# EAGLE schematic loa_v3 (EAGLE 6.5.0)

## Sheet 1 of 7
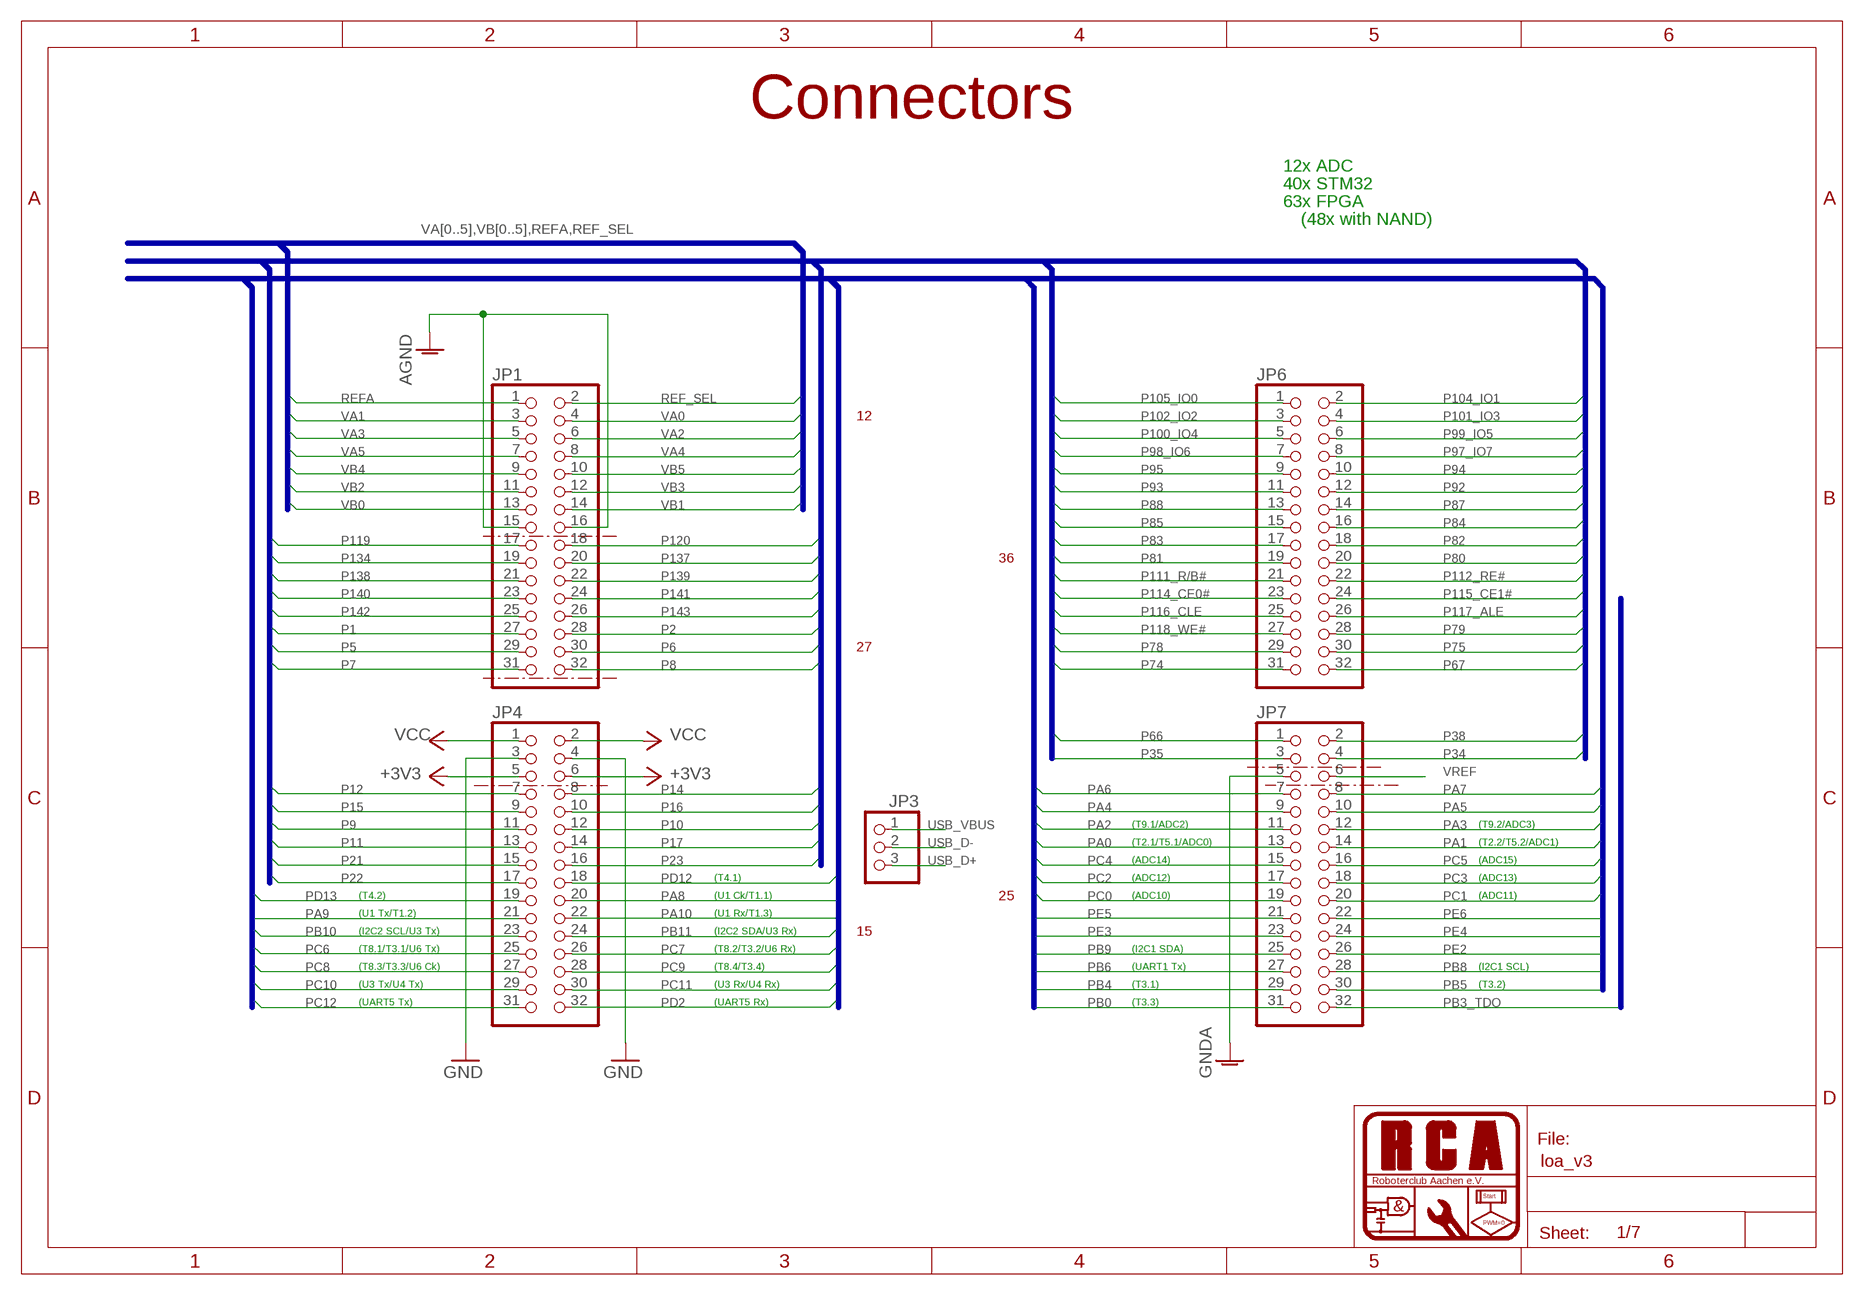
[diagram p0: schematic, sheet 1]

### Parts
JP1  PINHD-2X16_2.54  [2X16]
JP3  PINHD-1X3_2.54S  [1X03S]
JP4  PINHD-2X16_2.54  [2X16]
JP6  PINHD-2X16_2.54  [2X16]
JP7  PINHD-2X16_2.54  [2X16]

### Nets
+3V3: JP4.5 JP4.6 ; also sheet 2,3,4,5,6,7
AGND: JP1.15 JP1.16 ; also sheet 4
GND: JP4.3 JP4.4 ; also sheet 2,3,4,5,6,7
GNDA: JP7.5 ; also sheet 7
P1: JP1.27 ; also sheet 3
P2: JP1.28 ; also sheet 3
P5: JP1.29 ; also sheet 3
P6: JP1.30 ; also sheet 3
P7: JP1.31 ; also sheet 3
P8: JP1.32 ; also sheet 3
P9: JP4.11 ; also sheet 3
P10: JP4.12 ; also sheet 3
P11: JP4.13 ; also sheet 3
P12: JP4.7 ; also sheet 3
P14: JP4.8 ; also sheet 3
P15: JP4.9 ; also sheet 3
P16: JP4.10 ; also sheet 3
P17: JP4.14 ; also sheet 3
P21: JP4.15 ; also sheet 3
P22: JP4.17 ; also sheet 3
P23: JP4.16 ; also sheet 3
P34: JP7.4 ; also sheet 3
P35: JP7.3 ; also sheet 3
P38: JP7.2 ; also sheet 3
P66: JP7.1 ; also sheet 3
P67: JP6.32 ; also sheet 3
P74: JP6.31 ; also sheet 3
P75: JP6.30 ; also sheet 3
P78: JP6.29 ; also sheet 3
P79: JP6.28 ; also sheet 3
P80: JP6.20 ; also sheet 3
P81: JP6.19 ; also sheet 3
P82: JP6.18 ; also sheet 3
P83: JP6.17 ; also sheet 3
P84: JP6.16 ; also sheet 3
P85: JP6.15 ; also sheet 3
P87: JP6.14 ; also sheet 3
P88: JP6.13 ; also sheet 3
P92: JP6.12 ; also sheet 3
P93: JP6.11 ; also sheet 3
P94: JP6.10 ; also sheet 3
P95: JP6.9 ; also sheet 3
P97_IO7: JP6.8 ; also sheet 3,5
P98_IO6: JP6.7 ; also sheet 3,5
P99_IO5: JP6.6 ; also sheet 3,5
P100_IO4: JP6.5 ; also sheet 3,5
P101_IO3: JP6.4 ; also sheet 3,5
P102_IO2: JP6.3 ; also sheet 3,5
P104_IO1: JP6.2 ; also sheet 3,5
P105_IO0: JP6.1 ; also sheet 3,5
P111_R/B#: JP6.21 ; also sheet 3,5
P112_RE#: JP6.22 ; also sheet 3,5
P114_CE0#: JP6.23 ; also sheet 3,5
P115_CE1#: JP6.24 ; also sheet 3,5
P116_CLE: JP6.25 ; also sheet 3,5
P117_ALE: JP6.26 ; also sheet 3,5
P118_WE#: JP6.27 ; also sheet 3,5
P119: JP1.17 ; also sheet 3
P120: JP1.18 ; also sheet 3
P134: JP1.19 ; also sheet 3
P137: JP1.20 ; also sheet 3
P138: JP1.21 ; also sheet 3
P139: JP1.22 ; also sheet 3
P140: JP1.23 ; also sheet 3
P141: JP1.24 ; also sheet 3
P142: JP1.25 ; also sheet 3
P143: JP1.26 ; also sheet 3
PA0: JP7.13 ; also sheet 2
PA1: JP7.14 ; also sheet 2
PA2: JP7.11 ; also sheet 2
PA3: JP7.12 ; also sheet 2
PA4: JP7.9 ; also sheet 2
PA5: JP7.10 ; also sheet 2
PA6: JP7.7 ; also sheet 2
PA7: JP7.8 ; also sheet 2
PA8: JP4.20 ; also sheet 2
PA9: JP4.21 ; also sheet 2
PA10: JP4.22 ; also sheet 2
PB0: JP7.31 ; also sheet 2
PB3_TDO: JP7.32 ; also sheet 2
PB4: JP7.29 ; also sheet 2
PB5: JP7.30 ; also sheet 2
PB6: JP7.27 ; also sheet 2
PB8: JP7.28 ; also sheet 2
PB9: JP7.25 ; also sheet 2
PB10: JP4.23 ; also sheet 2
PB11: JP4.24 ; also sheet 2
PC0: JP7.19 ; also sheet 2
PC1: JP7.20 ; also sheet 2
PC2: JP7.17 ; also sheet 2
PC3: JP7.18 ; also sheet 2
PC4: JP7.15 ; also sheet 2
PC5: JP7.16 ; also sheet 2
PC6: JP4.25 ; also sheet 2
PC7: JP4.26 ; also sheet 2
PC8: JP4.27 ; also sheet 2
PC9: JP4.28 ; also sheet 2
PC10: JP4.29 ; also sheet 2
PC11: JP4.30 ; also sheet 2
PC12: JP4.31 ; also sheet 2
PD2: JP4.32 ; also sheet 2
PD12: JP4.18 ; also sheet 2
PD13: JP4.19 ; also sheet 2
PE2: JP7.26 ; also sheet 2
PE3: JP7.23 ; also sheet 2
PE4: JP7.24 ; also sheet 2
PE5: JP7.21 ; also sheet 2,5
PE6: JP7.22 ; also sheet 2,5
REF_SEL: JP1.2 ; also sheet 4
REFA: JP1.1 ; also sheet 4
USB_D+: JP3.3 ; also sheet 5
USB_D-: JP3.2 ; also sheet 5
USB_VBUS: JP3.1 ; also sheet 2,5,6
VA0: JP1.4 ; also sheet 4
VA1: JP1.3 ; also sheet 4
VA2: JP1.6 ; also sheet 4
VA3: JP1.5 ; also sheet 4
VA4: JP1.8 ; also sheet 4
VA5: JP1.7 ; also sheet 4
VB0: JP1.13 ; also sheet 4
VB1: JP1.14 ; also sheet 4
VB2: JP1.11 ; also sheet 4
VB3: JP1.12 ; also sheet 4
VB4: JP1.9 ; also sheet 4
VB5: JP1.10 ; also sheet 4
VCC: JP4.1 JP4.2 ; also sheet 6
VREF: JP7.6 ; also sheet 7

### Buses
VA[0..5],VB[0..5],REFA,REF_SEL
P[1..2],P[5..12],P[14..17],P[21..24],P[26..27],P[29..30],P[32..35],P38,P66,P67,P74,P75,P[78..85],P87,P88,P[92..95],P[97..102],P104,P105,P[111..112],P[114..121],P[123..124],P[126..127],P[131..134],P[137..143]
PA[0..10],PB0,PB[4..6],PB[8..11],PC[0..12],PD2,PD[12..13],PE[2..6]
JTAG:!RESET,TRST,TMS,TCK,PB3_TDO,TDI

### Notes on the sheet
- Connectors
- 12x ADC
- 40x STM32
- 63x FPGA
- (48x with NAND)
- 12
- 36
- 27
- (T9.1/ADC2) | (T9.2/ADC3)
- (T2.1/T5.1/ADC0) | (T2.2/T5.2/ADC1)
- (ADC14) | (ADC15)
- (T4.1) | (ADC12) | (ADC13)
- (T4.2) | (U1 Ck/T1.1) | 25 | (ADC10) | (ADC11)
- (U1 Tx/T1.2) | (U1 Rx/T1.3)
- (I2C2 SCL/U3 Tx) | (I2C2 SDA/U3 Rx) | 15
- (T8.1/T3.1/U6 Tx) | (T8.2/T3.2/U6 Rx) | (I2C1 SDA)
- (T8.3/T3.3/U6 Ck) | (T8.4/T3.4) | (UART1 Tx) | (I2C1 SCL)
- (U3 Tx/U4 Tx) | (U3 Rx/U4 Rx) | (T3.1) | (T3.2)
- (UART5 Tx) | (UART5 Rx) | (T3.3)

## Sheet 2 of 7
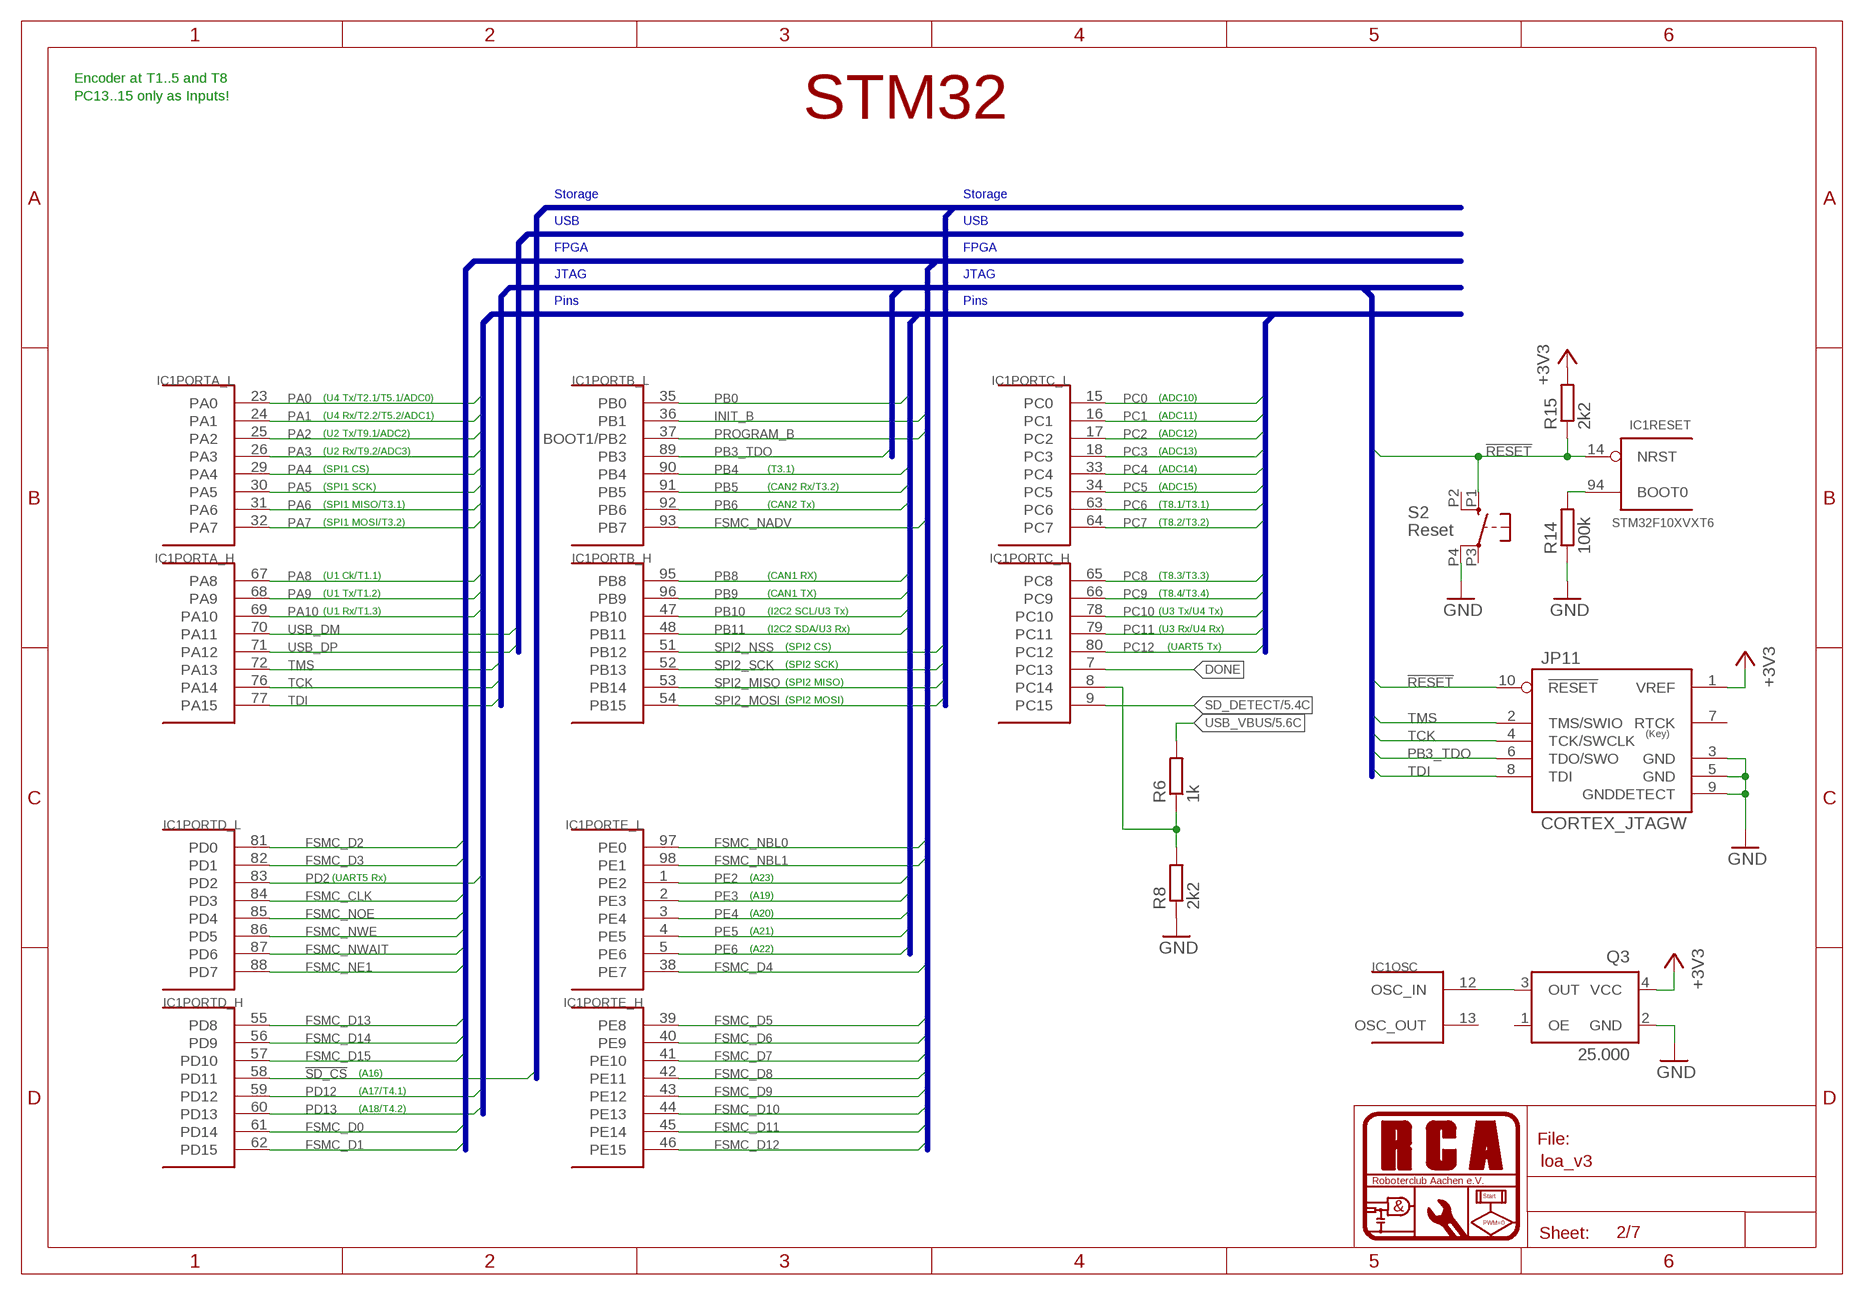
[diagram p1: schematic, sheet 2]

### Parts
IC1  STM32F10XVXT6  [TQFP100]
JP11  CORTEX_JTAGW  [ML10]
Q3  25.000  XO53  [XO53]
R6  1k  R-EU_R0603  [R0603]
R8  2k2  R-EU_R0603  [R0603]
R14  100k  R-EU_R0603  [R0603]
R15  2k2  R-EU_R0603  [R0603]
S2  Reset  10-XXLSH  [B3F-10XX-SMD]

### Nets
!RESET: IC1.14(RESET:NRST) JP11.10(!RESET) R15.1 S2.P1(S)
!SD_CS: IC1.58(PORTD_H:PD11) ; also sheet 5
+3V3: JP11.1(VREF) Q3.4(VCC) R15.2 ; also sheet 1,3,4,5,6,7
DONE: IC1.7(PORTC_H:PC13) ; also sheet 3
FSMC_CLK: IC1.84(PORTD_L:PD3) ; also sheet 3
FSMC_D0: IC1.61(PORTD_H:PD14) ; also sheet 3
FSMC_D1: IC1.62(PORTD_H:PD15) ; also sheet 3
FSMC_D2: IC1.81(PORTD_L:PD0) ; also sheet 3
FSMC_D3: IC1.82(PORTD_L:PD1) ; also sheet 3
FSMC_D4: IC1.38(PORTE_L:PE7) ; also sheet 3
FSMC_D5: IC1.39(PORTE_H:PE8) ; also sheet 3
FSMC_D6: IC1.40(PORTE_H:PE9) ; also sheet 3
FSMC_D7: IC1.41(PORTE_H:PE10) ; also sheet 3
FSMC_D8: IC1.42(PORTE_H:PE11) ; also sheet 3
FSMC_D9: IC1.43(PORTE_H:PE12) ; also sheet 3
FSMC_D10: IC1.44(PORTE_H:PE13) ; also sheet 3
FSMC_D11: IC1.45(PORTE_H:PE14) ; also sheet 3
FSMC_D12: IC1.46(PORTE_H:PE15) ; also sheet 3
FSMC_D13: IC1.55(PORTD_H:PD8) ; also sheet 3
FSMC_D14: IC1.56(PORTD_H:PD9) ; also sheet 3
FSMC_D15: IC1.57(PORTD_H:PD10) ; also sheet 3
FSMC_NADV: IC1.93(PORTB_L:PB7) ; also sheet 3
FSMC_NBL0: IC1.97(PORTE_L:PE0) ; also sheet 3
FSMC_NBL1: IC1.98(PORTE_L:PE1) ; also sheet 3
FSMC_NE1: IC1.88(PORTD_L:PD7) ; also sheet 3
FSMC_NOE: IC1.85(PORTD_L:PD4) ; also sheet 3
FSMC_NWAIT: IC1.87(PORTD_L:PD6) ; also sheet 3
FSMC_NWE: IC1.86(PORTD_L:PD5) ; also sheet 3
GND: JP11.3(GND) JP11.5(GND) JP11.9(GNDDETECT) Q3.2(GND) R8.1 R14.1 S2.P4(P1) ; also sheet 1,3,4,5,6,7
INIT_B: IC1.36(PORTB_L:PB1) ; also sheet 3
N$19: IC1.8(PORTC_H:PC14) R6.1 R8.2
N$41: IC1.94(RESET:BOOT0) R14.2
N$56: IC1.12(OSC:OSC_IN) Q3.3(OUT)
PA0: IC1.23(PORTA_L:PA0) ; also sheet 1
PA1: IC1.24(PORTA_L:PA1) ; also sheet 1
PA2: IC1.25(PORTA_L:PA2) ; also sheet 1
PA3: IC1.26(PORTA_L:PA3) ; also sheet 1
PA4: IC1.29(PORTA_L:PA4) ; also sheet 1
PA5: IC1.30(PORTA_L:PA5) ; also sheet 1
PA6: IC1.31(PORTA_L:PA6) ; also sheet 1
PA7: IC1.32(PORTA_L:PA7) ; also sheet 1
PA8: IC1.67(PORTA_H:PA8) ; also sheet 1
PA9: IC1.68(PORTA_H:PA9) ; also sheet 1
PA10: IC1.69(PORTA_H:PA10) ; also sheet 1
PB0: IC1.35(PORTB_L:PB0) ; also sheet 1
PB3_TDO: IC1.89(PORTB_L:PB3) JP11.6(TDO/SWO) ; also sheet 1
PB4: IC1.90(PORTB_L:PB4) ; also sheet 1
PB5: IC1.91(PORTB_L:PB5) ; also sheet 1
PB6: IC1.92(PORTB_L:PB6) ; also sheet 1
PB8: IC1.95(PORTB_H:PB8) ; also sheet 1
PB9: IC1.96(PORTB_H:PB9) ; also sheet 1
PB10: IC1.47(PORTB_H:PB10) ; also sheet 1
PB11: IC1.48(PORTB_H:PB11) ; also sheet 1
PC0: IC1.15(PORTC_L:PC0) ; also sheet 1
PC1: IC1.16(PORTC_L:PC1) ; also sheet 1
PC2: IC1.17(PORTC_L:PC2) ; also sheet 1
PC3: IC1.18(PORTC_L:PC3) ; also sheet 1
PC4: IC1.33(PORTC_L:PC4) ; also sheet 1
PC5: IC1.34(PORTC_L:PC5) ; also sheet 1
PC6: IC1.63(PORTC_L:PC6) ; also sheet 1
PC7: IC1.64(PORTC_L:PC7) ; also sheet 1
PC8: IC1.65(PORTC_H:PC8) ; also sheet 1
PC9: IC1.66(PORTC_H:PC9) ; also sheet 1
PC10: IC1.78(PORTC_H:PC10) ; also sheet 1
PC11: IC1.79(PORTC_H:PC11) ; also sheet 1
PC12: IC1.80(PORTC_H:PC12) ; also sheet 1
PD2: IC1.83(PORTD_L:PD2) ; also sheet 1
PD12: IC1.59(PORTD_H:PD12) ; also sheet 1
PD13: IC1.60(PORTD_H:PD13) ; also sheet 1
PE2: IC1.1(PORTE_L:PE2) ; also sheet 1
PE3: IC1.2(PORTE_L:PE3) ; also sheet 1
PE4: IC1.3(PORTE_L:PE4) ; also sheet 1
PE5: IC1.4(PORTE_L:PE5) ; also sheet 1,5
PE6: IC1.5(PORTE_L:PE6) ; also sheet 1,5
PROGRAM_B: IC1.37(PORTB_L:BOOT1/PB2) ; also sheet 3
SD_DETECT: IC1.9(PORTC_H:PC15) ; also sheet 5
SPI2_MISO: IC1.53(PORTB_H:PB14) ; also sheet 5
SPI2_MOSI: IC1.54(PORTB_H:PB15) ; also sheet 5
SPI2_NSS: IC1.51(PORTB_H:PB12) ; also sheet 5
SPI2_SCK: IC1.52(PORTB_H:PB13) ; also sheet 5
TCK: IC1.76(PORTA_H:PA14) JP11.4(TCK/SWCLK)
TDI: IC1.77(PORTA_H:PA15) JP11.8(TDI)
TMS: IC1.72(PORTA_H:PA13) JP11.2(TMS/SWIO)
USB_DM: IC1.70(PORTA_H:PA11) ; also sheet 5
USB_DP: IC1.71(PORTA_H:PA12) ; also sheet 5
USB_VBUS: R6.2 ; also sheet 1,5,6
Unconnected: IC1.13(OSC:OSC_OUT) JP11.7(RTCK) Q3.1(OE) S2.P2(S1) S2.P3(P)

### Buses
JTAG:!RESET,TRST,TMS,TCK,PB3_TDO,TDI
USB:USB_VBUS,USB_DM,USB_DP
PA[0..10],PB0,PB[4..6],PB[8..11],PC[0..12],PD2,PD[12..13],PE[2..6]
FPGA:FSMC_D[0..15],FSMC_NADV,FSMC_CLK,FSMC_NOE,FSMC_NWE,FSMC_NWAIT,FSMC_NE1,FSMC_NBL0,FSMC_NBL1,PROGRAM_B,INIT_B,DONE,CCLK
STORAGE:SPI2_NSS,SPI2_SCK,SPI2_MOSI,SPI2_MISO,SD_DETECT,!SD_CS

### Notes on the sheet
- Encoder at T1..5 and T8
- PC13..15 only as Inputs!
- STM32
- Storage | Storage
- USB | USB
- FPGA | FPGA
- JTAG | JTAG
- Pins | Pins
- (U4 Tx/T2.1/T5.1/ADC0) | (ADC10)
- (U4 Rx/T2.2/T5.2/ADC1) | (ADC11)
- (U2 Tx/T9.1/ADC2) | (ADC12)
- (U2 Rx/T9.2/ADC3) | (ADC13)
- (SPI1 CS) | (T3.1) | (ADC14)
- (SPI1 SCK) | (CAN2 Rx/T3.2) | (ADC15)
- (SPI1 MISO/T3.1) | (CAN2 Tx) | (T8.1/T3.1)
- (SPI1 MOSI/T3.2) | (T8.2/T3.2)
- (U1 Ck/T1.1) | (CAN1 RX) | (T8.3/T3.3)
- (U1 Tx/T1.2) | (CAN1 TX) | (T8.4/T3.4)
- (U1 Rx/T1.3) | (I2C2 SCL/U3 Tx) | (U3 Tx/U4 Tx)
- (I2C2 SDA/U3 Rx) | (U3 Rx/U4 Rx)
- (SPI2 CS) | (UART5 Tx)
- (SPI2 SCK)
- (SPI2 MISO)
- (SPI2 MOSI)
- (UART5 Rx) | (A23)
- (A19)
- (A20)
- (A21)
- (A22)
- (A16)
- (A17/T4.1)
- (A18/T4.2)

## Sheet 3 of 7
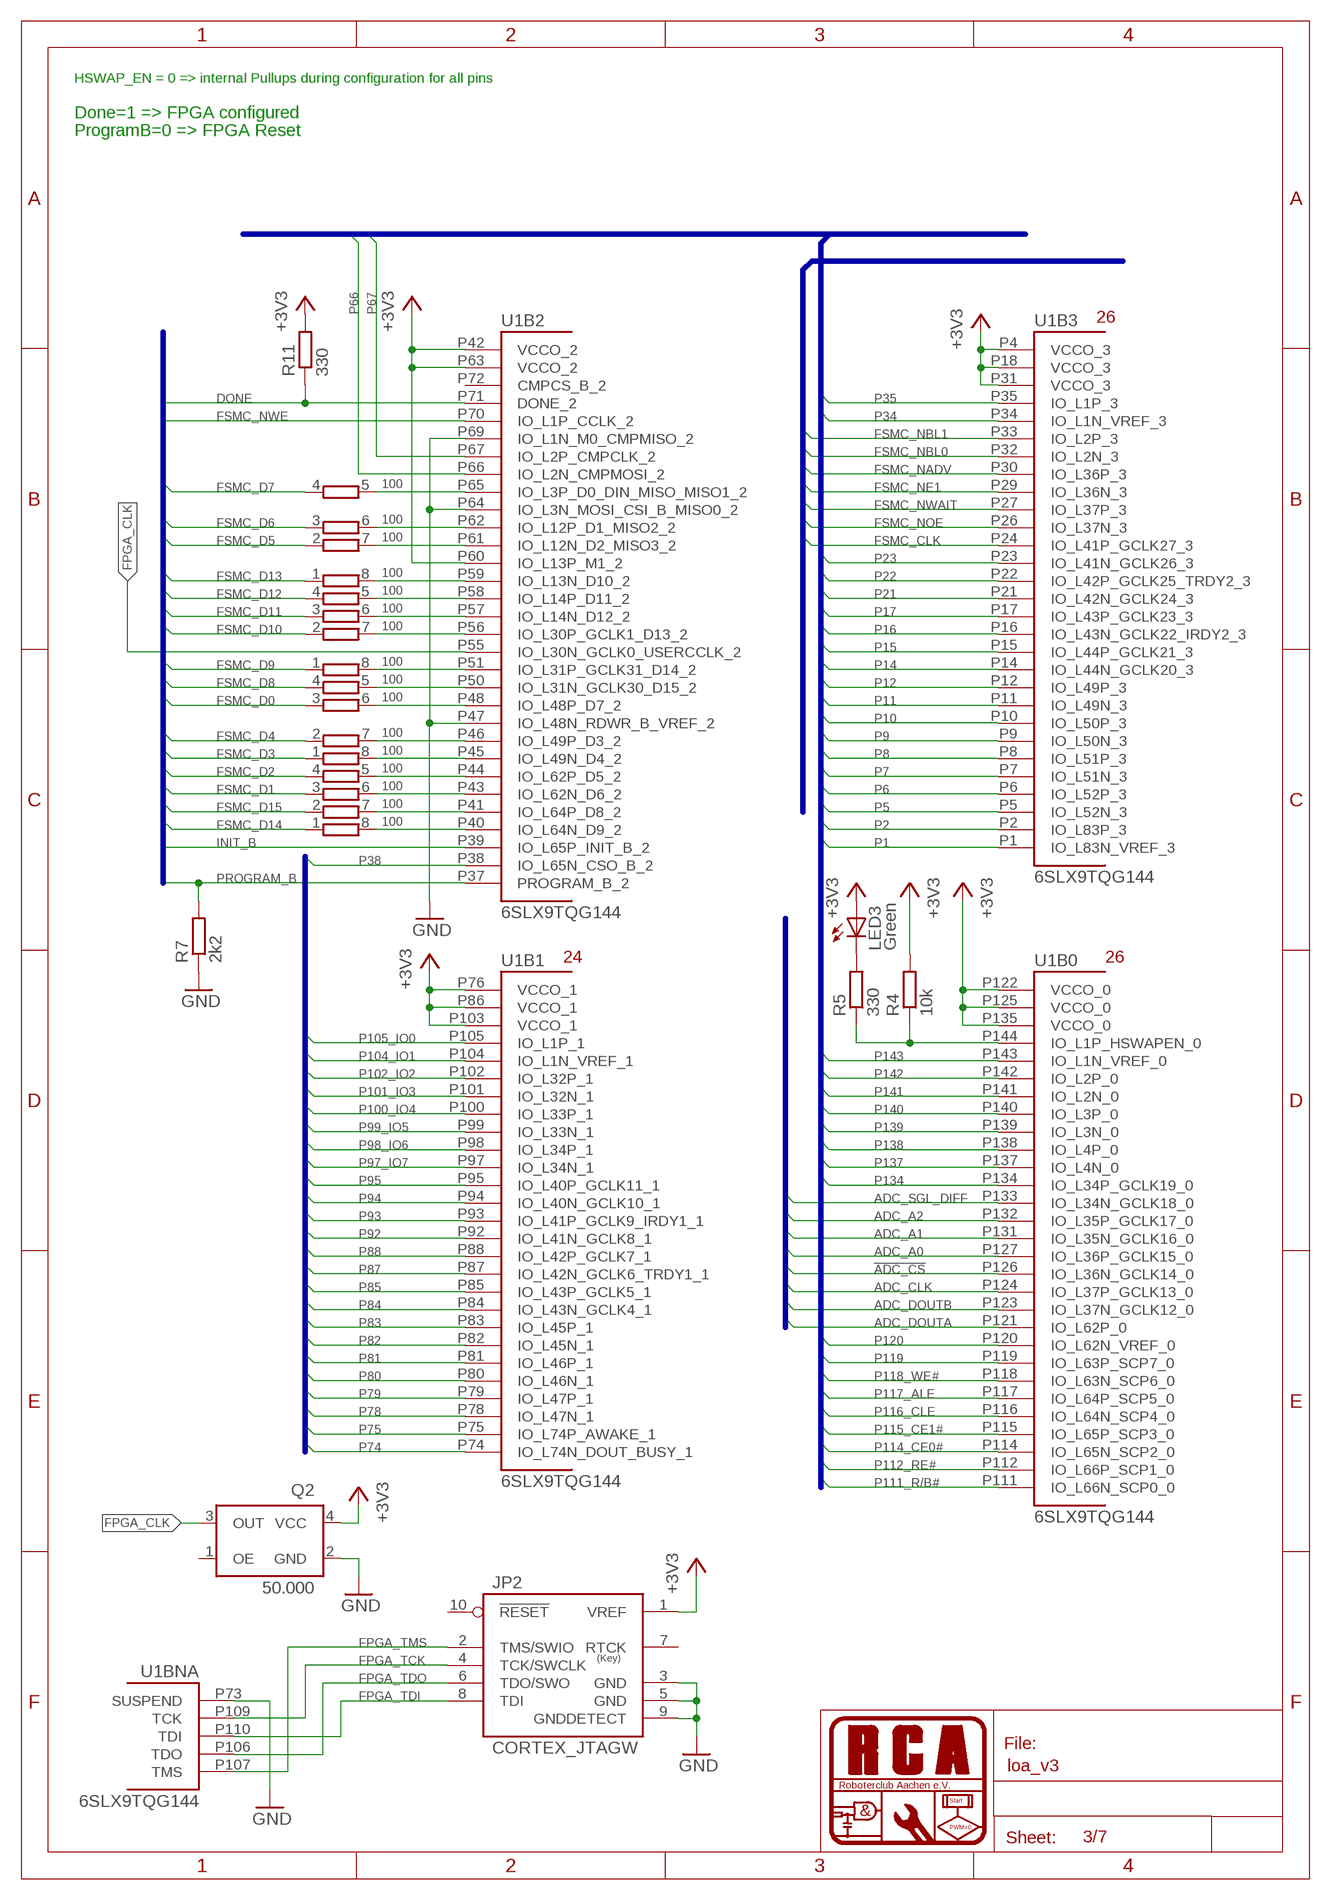
[diagram p2: schematic, sheet 3]

### Parts
JP2  CORTEX_JTAGW  [ML10]
LED3  Green  LEDCHIPLED_0805  [CHIPLED_0805]
Q2  50.000  XO53  [XO53]
R4  10k  R-EU_R0603  [R0603]
R5  330  R-EU_R0603  [R0603]
R7  2k2  R-EU_R0805  [R0805]
R11  330  R-EU_R0603  [R0603]
RN3  100  4R-NEXB38V  [EXB38V]
RN4  100  4R-NEXB38V  [EXB38V]
RN6  100  4R-NEXB38V  [EXB38V]
RN7  100  4R-NEXB38V  [EXB38V]
U1  6SLX9TQG144  [TQ144]

### Nets
!ADC_CS: U1.P126(B0:IO_L36N_GCLK14_0) ; also sheet 4
+3V3: JP2.1(VREF) LED3.A Q2.4(VCC) R4.2 R11.2 U1.P4(B3:VCCO_3) U1.P18(B3:VCCO_3) U1.P31(B3:VCCO_3) U1.P42(B2:VCCO_2) U1.P60(B2:IO_L13P_M1_2) U1.P63(B2:VCCO_2) U1.P76(B1:VCCO_1) U1.P86(B1:VCCO_1) U1.P103(B1:VCCO_1) U1.P122(B0:VCCO_0) U1.P125(B0:VCCO_0) U1.P135(B0:VCCO_0) ; also sheet 1,2,4,5,6,7
ADC_A0: U1.P127(B0:IO_L36P_GCLK15_0) ; also sheet 4
ADC_A1: U1.P131(B0:IO_L35N_GCLK16_0) ; also sheet 4
ADC_A2: U1.P132(B0:IO_L35P_GCLK17_0) ; also sheet 4
ADC_CLK: U1.P124(B0:IO_L37P_GCLK13_0) ; also sheet 4
ADC_DOUTA: U1.P121(B0:IO_L62P_0) ; also sheet 4
ADC_DOUTB: U1.P123(B0:IO_L37N_GCLK12_0) ; also sheet 4
ADC_SGL_DIFF: U1.P133(B0:IO_L34N_GCLK18_0) ; also sheet 4
DONE: R11.1 U1.P71(B2:DONE_2) ; also sheet 2
FPGA_CLK: Q2.3(OUT) U1.P55(B2:IO_L30N_GCLK0_USERCCLK_2)
FPGA_TCK: JP2.4(TCK/SWCLK) U1.P109(BNA:TCK)
FPGA_TDI: JP2.8(TDI) U1.P110(BNA:TDI)
FPGA_TDO: JP2.6(TDO/SWO) U1.P106(BNA:TDO)
FPGA_TMS: JP2.2(TMS/SWIO) U1.P107(BNA:TMS)
FSMC_CLK: U1.P24(B3:IO_L41P_GCLK27_3) ; also sheet 2
FSMC_D0: RN7.3 ; also sheet 2
FSMC_D1: RN4.3 ; also sheet 2
FSMC_D2: RN4.4 ; also sheet 2
FSMC_D3: RN7.1 ; also sheet 2
FSMC_D4: RN7.2 ; also sheet 2
FSMC_D5: RN3.2 ; also sheet 2
FSMC_D6: RN3.3 ; also sheet 2
FSMC_D7: RN3.4 ; also sheet 2
FSMC_D8: RN7.4 ; also sheet 2
FSMC_D9: RN6.1 ; also sheet 2
FSMC_D10: RN6.2 ; also sheet 2
FSMC_D11: RN6.3 ; also sheet 2
FSMC_D12: RN6.4 ; also sheet 2
FSMC_D13: RN3.1 ; also sheet 2
FSMC_D14: RN4.1 ; also sheet 2
FSMC_D15: RN4.2 ; also sheet 2
FSMC_NADV: U1.P30(B3:IO_L36P_3) ; also sheet 2
FSMC_NBL0: U1.P32(B3:IO_L2N_3) ; also sheet 2
FSMC_NBL1: U1.P33(B3:IO_L2P_3) ; also sheet 2
FSMC_NE1: U1.P29(B3:IO_L36N_3) ; also sheet 2
FSMC_NOE: U1.P26(B3:IO_L37N_3) ; also sheet 2
FSMC_NWAIT: U1.P27(B3:IO_L37P_3) ; also sheet 2
FSMC_NWE: U1.P70(B2:IO_L1P_CCLK_2) ; also sheet 2
GND: JP2.3(GND) JP2.5(GND) JP2.9(GNDDETECT) Q2.2(GND) R7.1 U1.P47(B2:IO_L48N_RDWR_B_VREF_2) U1.P64(B2:IO_L3N_MOSI_CSI_B_MISO0_2) U1.P69(B2:IO_L1N_M0_CMPMISO_2) U1.P73(BNA:SUSPEND) ; also sheet 1,2,4,5,6,7
INIT_B: U1.P39(B2:IO_L65P_INIT_B_2) ; also sheet 2
N$2: RN3.5 U1.P65(B2:IO_L3P_D0_DIN_MISO_MISO1_2)
N$3: RN3.6 U1.P62(B2:IO_L12P_D1_MISO2_2)
N$5: RN3.7 U1.P61(B2:IO_L12N_D2_MISO3_2)
N$6: RN3.8 U1.P59(B2:IO_L13N_D10_2)
N$7: RN6.5 U1.P58(B2:IO_L14P_D11_2)
N$8: RN6.6 U1.P57(B2:IO_L14N_D12_2)
N$9: RN6.7 U1.P56(B2:IO_L30P_GCLK1_D13_2)
N$10: RN6.8 U1.P51(B2:IO_L31P_GCLK31_D14_2)
N$11: RN7.5 U1.P50(B2:IO_L31N_GCLK30_D15_2)
N$12: RN7.6 U1.P48(B2:IO_L48P_D7_2)
N$13: RN7.7 U1.P46(B2:IO_L49P_D3_2)
N$14: RN7.8 U1.P45(B2:IO_L49N_D4_2)
N$15: RN4.5 U1.P44(B2:IO_L62P_D5_2)
N$16: LED3.C R5.2
N$20: R4.1 R5.1 U1.P144(B0:IO_L1P_HSWAPEN_0)
N$35: RN4.7 U1.P41(B2:IO_L64P_D8_2)
N$44: RN4.6 U1.P43(B2:IO_L62N_D6_2)
N$45: RN4.8 U1.P40(B2:IO_L64N_D9_2)
P1: U1.P1(B3:IO_L83N_VREF_3) ; also sheet 1
P2: U1.P2(B3:IO_L83P_3) ; also sheet 1
P5: U1.P5(B3:IO_L52N_3) ; also sheet 1
P6: U1.P6(B3:IO_L52P_3) ; also sheet 1
P7: U1.P7(B3:IO_L51N_3) ; also sheet 1
P8: U1.P8(B3:IO_L51P_3) ; also sheet 1
P9: U1.P9(B3:IO_L50N_3) ; also sheet 1
P10: U1.P10(B3:IO_L50P_3) ; also sheet 1
P11: U1.P11(B3:IO_L49N_3) ; also sheet 1
P12: U1.P12(B3:IO_L49P_3) ; also sheet 1
P14: U1.P14(B3:IO_L44N_GCLK20_3) ; also sheet 1
P15: U1.P15(B3:IO_L44P_GCLK21_3) ; also sheet 1
P16: U1.P16(B3:IO_L43N_GCLK22_IRDY2_3) ; also sheet 1
P17: U1.P17(B3:IO_L43P_GCLK23_3) ; also sheet 1
P21: U1.P21(B3:IO_L42N_GCLK24_3) ; also sheet 1
P22: U1.P22(B3:IO_L42P_GCLK25_TRDY2_3) ; also sheet 1
P23: U1.P23(B3:IO_L41N_GCLK26_3) ; also sheet 1
P34: U1.P34(B3:IO_L1N_VREF_3) ; also sheet 1
P35: U1.P35(B3:IO_L1P_3) ; also sheet 1
P38: U1.P38(B2:IO_L65N_CSO_B_2) ; also sheet 1
P66: U1.P66(B2:IO_L2N_CMPMOSI_2) ; also sheet 1
P67: U1.P67(B2:IO_L2P_CMPCLK_2) ; also sheet 1
P74: U1.P74(B1:IO_L74N_DOUT_BUSY_1) ; also sheet 1
P75: U1.P75(B1:IO_L74P_AWAKE_1) ; also sheet 1
P78: U1.P78(B1:IO_L47N_1) ; also sheet 1
P79: U1.P79(B1:IO_L47P_1) ; also sheet 1
P80: U1.P80(B1:IO_L46N_1) ; also sheet 1
P81: U1.P81(B1:IO_L46P_1) ; also sheet 1
P82: U1.P82(B1:IO_L45N_1) ; also sheet 1
P83: U1.P83(B1:IO_L45P_1) ; also sheet 1
P84: U1.P84(B1:IO_L43N_GCLK4_1) ; also sheet 1
P85: U1.P85(B1:IO_L43P_GCLK5_1) ; also sheet 1
P87: U1.P87(B1:IO_L42N_GCLK6_TRDY1_1) ; also sheet 1
P88: U1.P88(B1:IO_L42P_GCLK7_1) ; also sheet 1
P92: U1.P92(B1:IO_L41N_GCLK8_1) ; also sheet 1
P93: U1.P93(B1:IO_L41P_GCLK9_IRDY1_1) ; also sheet 1
P94: U1.P94(B1:IO_L40N_GCLK10_1) ; also sheet 1
P95: U1.P95(B1:IO_L40P_GCLK11_1) ; also sheet 1
P97_IO7: U1.P97(B1:IO_L34N_1) ; also sheet 1,5
P98_IO6: U1.P98(B1:IO_L34P_1) ; also sheet 1,5
P99_IO5: U1.P99(B1:IO_L33N_1) ; also sheet 1,5
P100_IO4: U1.P100(B1:IO_L33P_1) ; also sheet 1,5
P101_IO3: U1.P101(B1:IO_L32N_1) ; also sheet 1,5
P102_IO2: U1.P102(B1:IO_L32P_1) ; also sheet 1,5
P104_IO1: U1.P104(B1:IO_L1N_VREF_1) ; also sheet 1,5
P105_IO0: U1.P105(B1:IO_L1P_1) ; also sheet 1,5
P111_R/B#: U1.P111(B0:IO_L66N_SCP0_0) ; also sheet 1,5
P112_RE#: U1.P112(B0:IO_L66P_SCP1_0) ; also sheet 1,5
P114_CE0#: U1.P114(B0:IO_L65N_SCP2_0) ; also sheet 1,5
P115_CE1#: U1.P115(B0:IO_L65P_SCP3_0) ; also sheet 1,5
P116_CLE: U1.P116(B0:IO_L64N_SCP4_0) ; also sheet 1,5
P117_ALE: U1.P117(B0:IO_L64P_SCP5_0) ; also sheet 1,5
P118_WE#: U1.P118(B0:IO_L63N_SCP6_0) ; also sheet 1,5
P119: U1.P119(B0:IO_L63P_SCP7_0) ; also sheet 1
P120: U1.P120(B0:IO_L62N_VREF_0) ; also sheet 1
P134: U1.P134(B0:IO_L34P_GCLK19_0) ; also sheet 1
P137: U1.P137(B0:IO_L4N_0) ; also sheet 1
P138: U1.P138(B0:IO_L4P_0) ; also sheet 1
P139: U1.P139(B0:IO_L3N_0) ; also sheet 1
P140: U1.P140(B0:IO_L3P_0) ; also sheet 1
P141: U1.P141(B0:IO_L2N_0) ; also sheet 1
P142: U1.P142(B0:IO_L2P_0) ; also sheet 1
P143: U1.P143(B0:IO_L1N_VREF_0) ; also sheet 1
PROGRAM_B: R7.2 U1.P37(B2:PROGRAM_B_2) ; also sheet 2
Unconnected: JP2.7(RTCK) JP2.10(!RESET) Q2.1(OE) U1.P72(B2:CMPCS_B_2)

### Buses
FPGA:FSMC_D[0..15],FSMC_NADV,FSMC_CLK,FSMC_NOE,FSMC_NWE,FSMC_NWAIT,FSMC_NE1,FSMC_NBL0,FSMC_NBL1,PROGRAM_B,INIT_B,DONE,CCLK
ADC:!ADC_CS,ADC_CLK,ADC_DOUTA,ADC_DOUTB,ADC_A[0..2],ADC_SGL_DIFF
P[1..2],P[5..12],P[14..17],P[21..24],P[26..27],P[29..30],P[32..35],P38,P66,P67,P74,P75,P[78..85],P87,P88,P[92..95],P[97..102],P104,P105,P[111..112],P[114..121],P[123..124],P[126..127],P[131..134],P[137..143]

### Notes on the sheet
- HSWAP_EN = 0 => internal Pullups during configuration for all pins
- Done=1 => FPGA configured
- ProgramB=0 => FPGA Reset
- 26
- 24 | 26

## Sheet 4 of 7
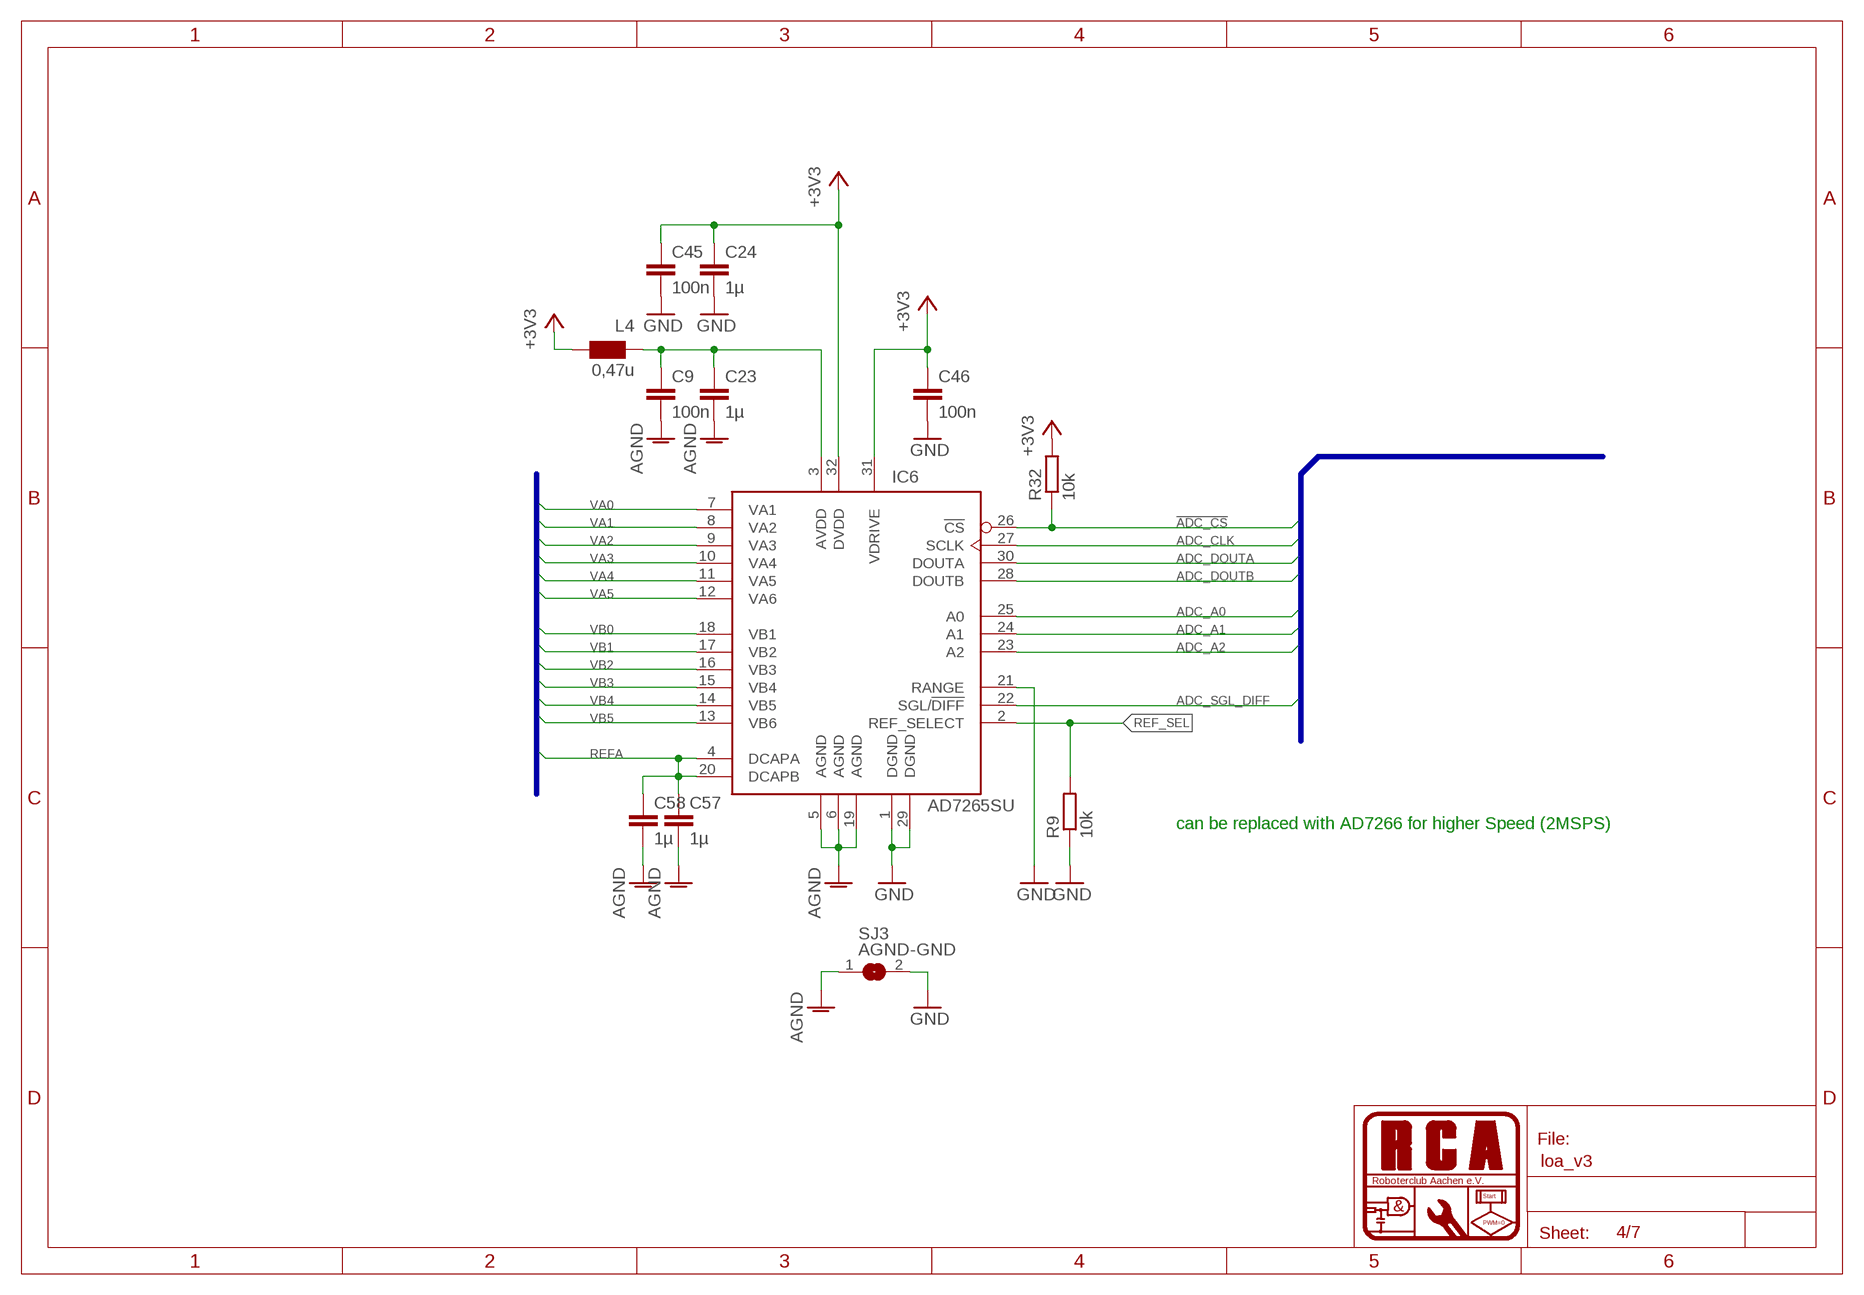
[diagram p3: schematic, sheet 4]

### Parts
C9  100n  C-EUC0603  [C0603]
C23  1µ  C-EUC0805  [C0805]
C24  1µ  C-EUC0805  [C0805]
C45  100n  C-EUC0603  [C0603]
C46  100n  C-EUC0603  [C0603]
C57  1µ  C-EUC0805  [C0805]
C58  1µ  C-EUC0805  [C0805]
IC6  AD7265SU  AD7266SU  [TQFP32-08]
L4  0,47u  WE-KIHQ_0805  [WE-KI_0805_B]
R9  10k  R-EU_R0603  [R0603]
R32  10k  R-EU_R0603  [R0603]
SJ3  AGND-GND  SJS  [SJS]

### Nets
!ADC_CS: IC6.26(!CS) R32.1 ; also sheet 3
+3V3: C24.1 C45.1 C46.1 IC6.31(VDRIVE) IC6.32(DVDD) L4.1 R32.2 ; also sheet 1,2,3,5,6,7
ADC_A0: IC6.25(A0) ; also sheet 3
ADC_A1: IC6.24(A1) ; also sheet 3
ADC_A2: IC6.23(A2) ; also sheet 3
ADC_CLK: IC6.27(SCLK) ; also sheet 3
ADC_DOUTA: IC6.30(DOUTA) ; also sheet 3
ADC_DOUTB: IC6.28(DOUTB) ; also sheet 3
ADC_SGL_DIFF: IC6.22(SGL/!DIFF) ; also sheet 3
AGND: C9.2 C23.2 C57.2 C58.2 IC6.5(AGND) IC6.6(AGND) IC6.19(AGND) SJ3.1 ; also sheet 1
GND: C24.2 C45.2 C46.2 IC6.1(DGND) IC6.21(RANGE) IC6.29(DGND) R9.1 SJ3.2 ; also sheet 1,2,3,5,6,7
N$55: C9.1 C23.1 IC6.3(AVDD) L4.2
REF_SEL: IC6.2(REF_SELECT) R9.2 ; also sheet 1
REFA: C57.1 C58.1 IC6.4(DCAPA) IC6.20(DCAPB) ; also sheet 1
VA0: IC6.7(VA1) ; also sheet 1
VA1: IC6.8(VA2) ; also sheet 1
VA2: IC6.9(VA3) ; also sheet 1
VA3: IC6.10(VA4) ; also sheet 1
VA4: IC6.11(VA5) ; also sheet 1
VA5: IC6.12(VA6) ; also sheet 1
VB0: IC6.18(VB1) ; also sheet 1
VB1: IC6.17(VB2) ; also sheet 1
VB2: IC6.16(VB3) ; also sheet 1
VB3: IC6.15(VB4) ; also sheet 1
VB4: IC6.14(VB5) ; also sheet 1
VB5: IC6.13(VB6) ; also sheet 1

### Buses
VA[0..5],VB[0..5],REFA,REF_SEL
ADC:!ADC_CS,ADC_CLK,ADC_DOUTA,ADC_DOUTB,ADC_A[0..2],ADC_SGL_DIFF

### Notes on the sheet
- can be replaced with AD7266 for higher Speed (2MSPS)

## Sheet 5 of 7
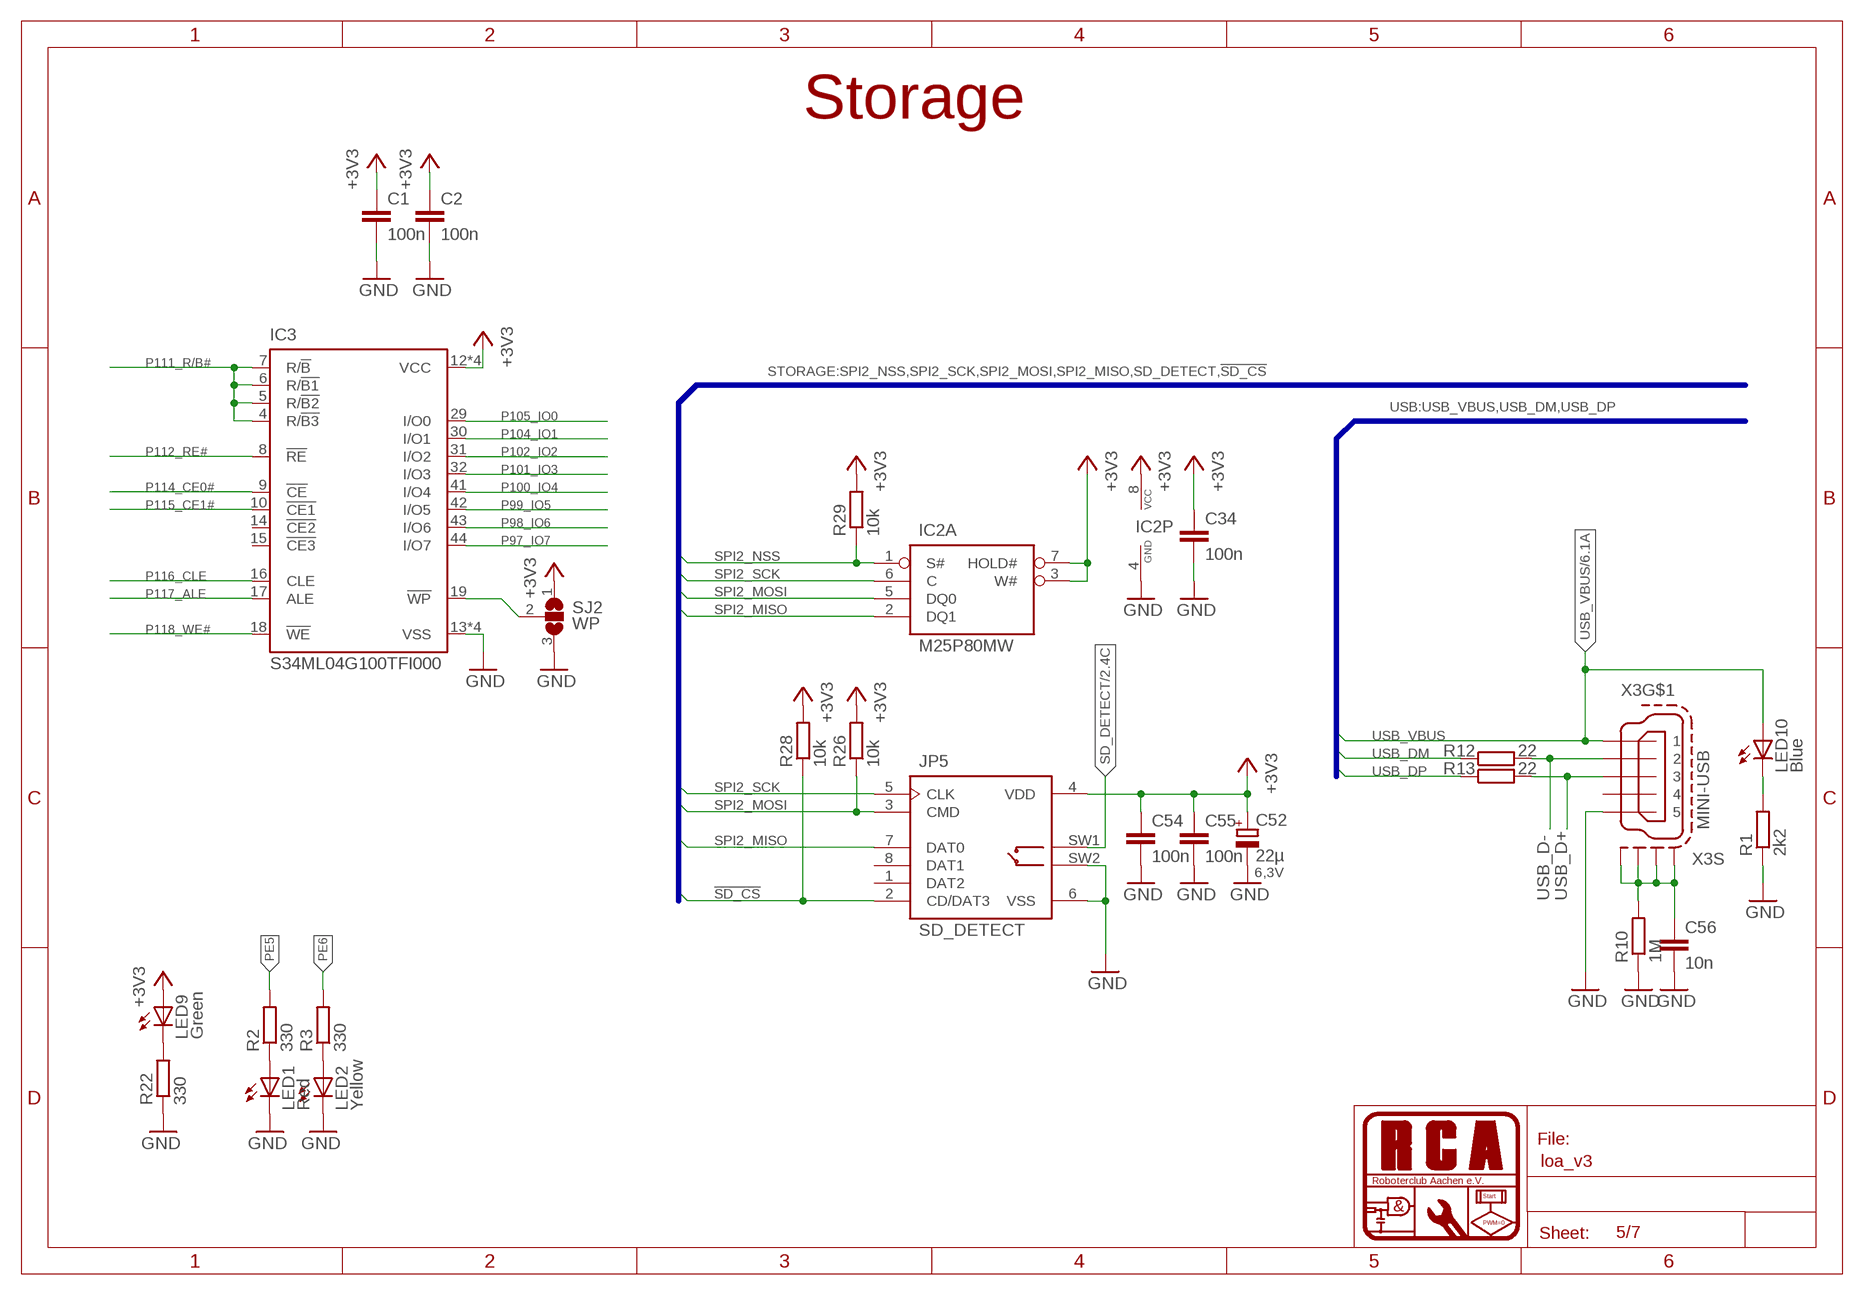
[diagram p4: schematic, sheet 5]

### Parts
C1  100n  C-EUC0603  [C0603]
C2  100n  C-EUC0603  [C0603]
C34  100n  C-EUC0603  [C0603]
C52  22µ  CPOL-EUSMCC  [SMC_C]
C54  100n  C-EUC0603  [C0603]
C55  100n  C-EUC0603  [C0603]
C56  10n  C-EUC0603  [C0603]
IC2  M25P80MW  [SO-08M]
IC3  S34ML04G100TFI000  NAND_FLASH  [TSOP48]
JP5  SD_DETECT  [SD_MOLEX_49225-0821]
LED1  Red  LEDCHIPLED_0805  [CHIPLED_0805]
LED2  Yellow  LEDCHIPLED_0805  [CHIPLED_0805]
LED9  Green  LEDCHIPLED_0805  [CHIPLED_0805]
LED10  Blue  LEDCHIPLED_0805  [CHIPLED_0805]
R1  2k2  R-EU_R0805  [R0805]
R2  330  R-EU_R0603  [R0603]
R3  330  R-EU_R0603  [R0603]
R10  1M  R-EU_R0805  [R0805]
R12  22  R-EU_R0603  [R0603]
R13  22  R-EU_R0603  [R0603]
R22  330  R-EU_R0603  [R0603]
R26  10k  R-EU_R0603  [R0603]
R28  10k  R-EU_R0603  [R0603]
R29  10k  R-EU_R0603  [R0603]
SJ2  WP  SJ2WS  [SJ_2S]
X3  MINI-USB  MINI-USB-SCHIELD-32005-201  [32005-201]

### Nets
!SD_CS: JP5.2(CD/DAT3) R28.1 ; also sheet 2
+3V3: C1.1 C2.1 C34.1 C52.+ C54.1 C55.1 IC2.3(A:W#) IC2.7(A:HOLD#) IC2.8(P:VCC) IC3.12(VCC) IC3.34(VCC) IC3.37(VCC) IC3.39(VCC) JP5.4(VDD) LED9.A R26.2 R28.2 R29.2 SJ2.1 ; also sheet 1,2,3,4,6,7
GND: C1.2 C2.2 C34.2 C52.- C54.2 C55.2 C56.2 IC2.4(P:GND) IC3.13(VSS) IC3.25(VSS) IC3.36(VSS) IC3.48(VSS) JP5.6(VSS) JP5.SW2 LED1.C LED2.C R1.1 R10.1 R22.1 SJ2.3 X3.5 ; also sheet 1,2,3,4,6,7
N$1: LED1.A R2.1
N$17: IC3.19(!WP) SJ2.2
N$18: LED2.A R3.1
N$26: LED9.C R22.2
N$33: LED10.C R1.2
N$42: C56.1 R10.2 X3.M1(S:S1) X3.M2(S:S2) X3.M3(S:S3) X3.M4(S:S4)
P97_IO7: IC3.44(I/O7) ; also sheet 1,3
P98_IO6: IC3.43(I/O6) ; also sheet 1,3
P99_IO5: IC3.42(I/O5) ; also sheet 1,3
P100_IO4: IC3.41(I/O4) ; also sheet 1,3
P101_IO3: IC3.32(I/O3) ; also sheet 1,3
P102_IO2: IC3.31(I/O2) ; also sheet 1,3
P104_IO1: IC3.30(I/O1) ; also sheet 1,3
P105_IO0: IC3.29(I/O0) ; also sheet 1,3
P111_R/B#: IC3.4(R/!B3) IC3.5(R/!B2) IC3.6(R/!B1) IC3.7(R/!B) ; also sheet 1,3
P112_RE#: IC3.8(!RE) ; also sheet 1,3
P114_CE0#: IC3.9(!CE) ; also sheet 1,3
P115_CE1#: IC3.10(!CE1) ; also sheet 1,3
P116_CLE: IC3.16(CLE) ; also sheet 1,3
P117_ALE: IC3.17(ALE) ; also sheet 1,3
P118_WE#: IC3.18(!WE) ; also sheet 1,3
PE5: R2.2 ; also sheet 1,2
PE6: R3.2 ; also sheet 1,2
SD_DETECT: JP5.SW1 ; also sheet 2
SPI2_MISO: IC2.2(A:DQ1) JP5.7(DAT0) ; also sheet 2
SPI2_MOSI: IC2.5(A:DQ0) JP5.3(CMD) R26.1 ; also sheet 2
SPI2_NSS: IC2.1(A:S#) R29.1 ; also sheet 2
SPI2_SCK: IC2.6(A:C) JP5.5(CLK) ; also sheet 2
USB_D+: R13.2 X3.3 ; also sheet 1
USB_D-: R12.2 X3.2 ; also sheet 1
USB_DM: R12.1 ; also sheet 2
USB_DP: R13.1 ; also sheet 2
USB_VBUS: LED10.A X3.1 ; also sheet 1,2,6
Unconnected: IC3.14(!CE2) IC3.15(!CE3) JP5.1(DAT2) JP5.8(DAT1) X3.4

### Buses
USB:USB_VBUS,USB_DM,USB_DP
STORAGE:SPI2_NSS,SPI2_SCK,SPI2_MOSI,SPI2_MISO,SD_DETECT,!SD_CS

### Notes on the sheet
- Storage

## Sheet 6 of 7
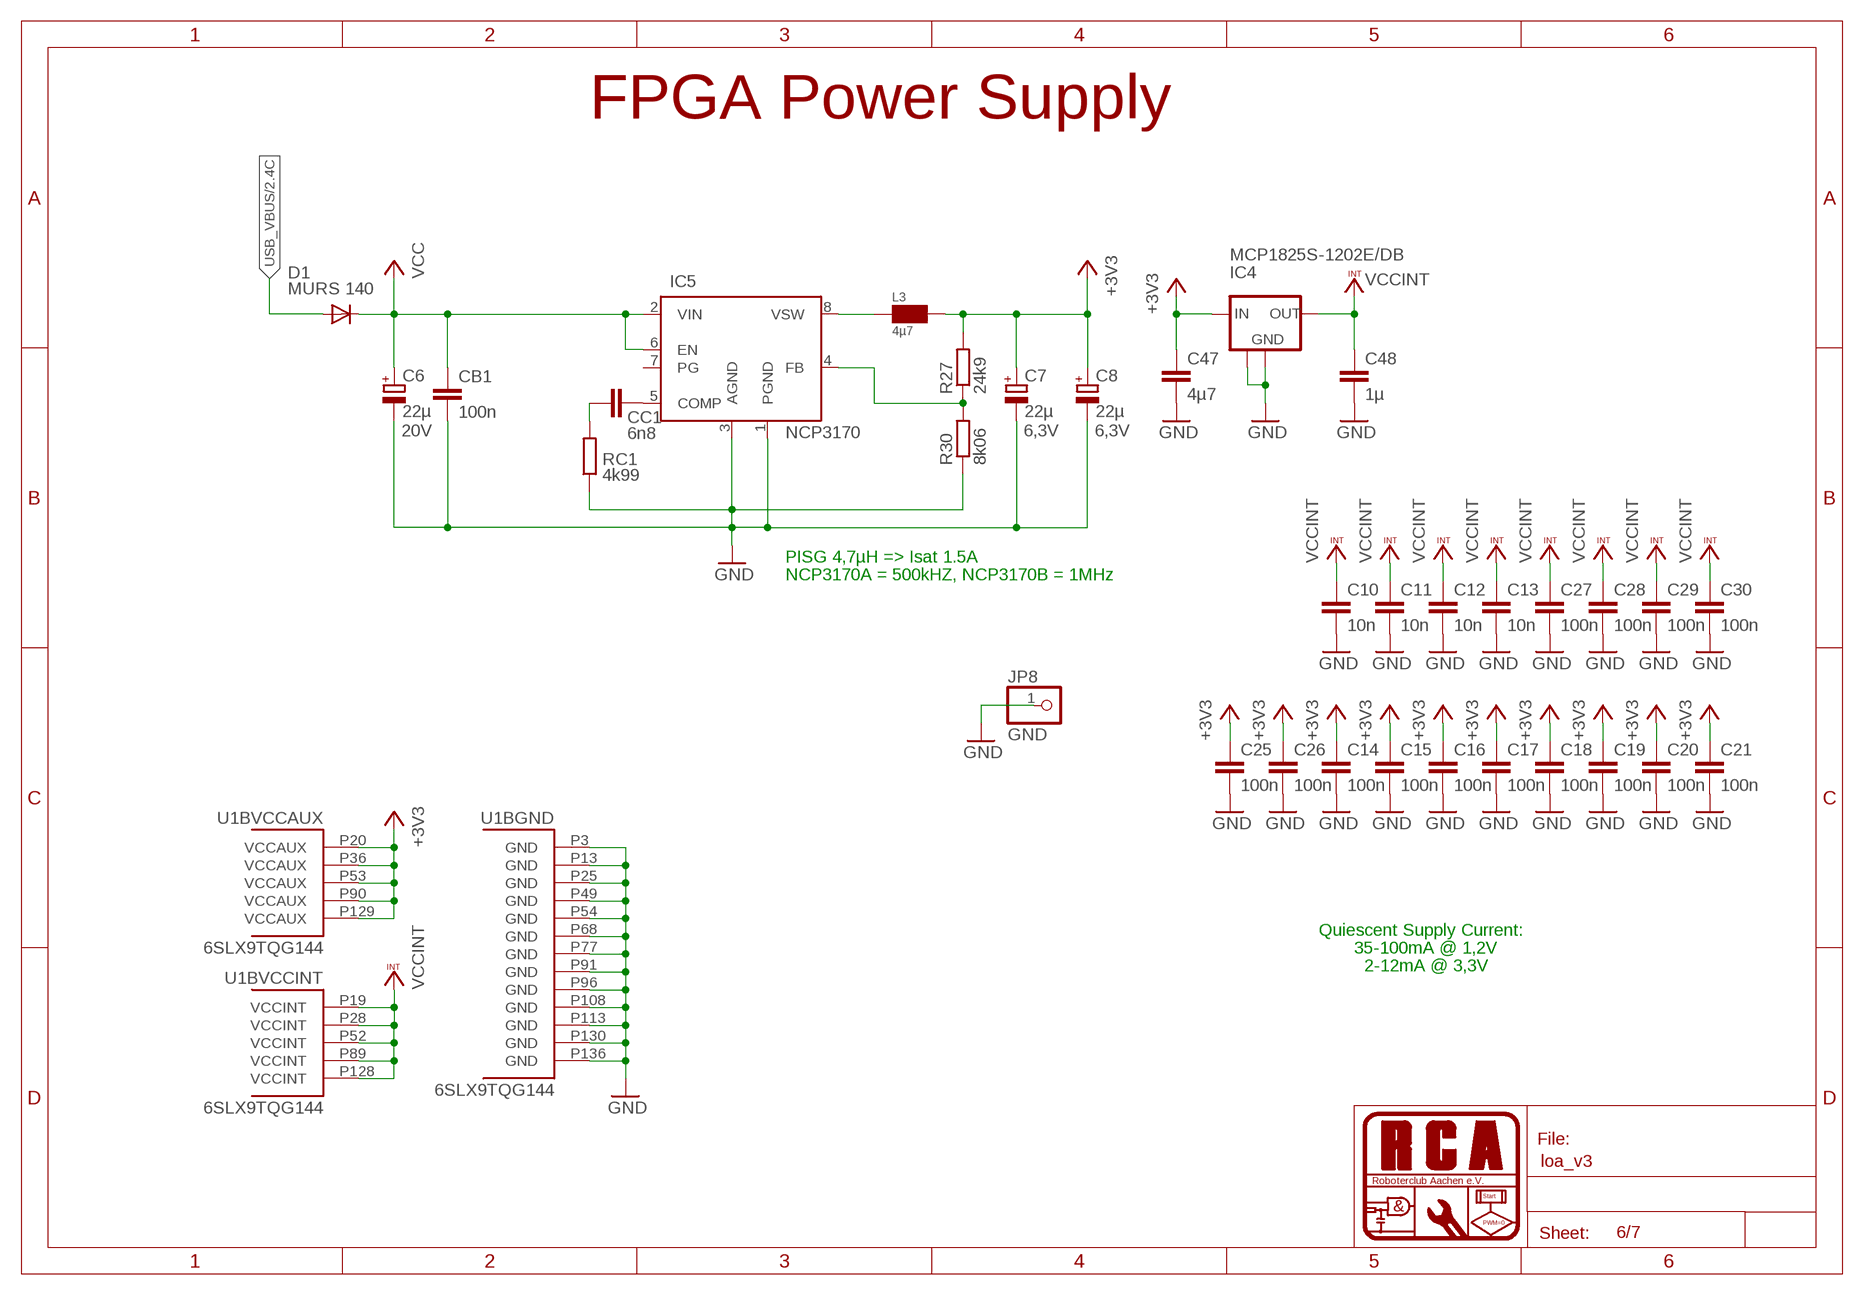
[diagram p5: schematic, sheet 6]

### Parts
C6  22µ  CPOL-EUSMCD  [SMC_D]
C7  22µ  CPOL-EUSMCC  [SMC_C]
C8  22µ  CPOL-EUSMCC  [SMC_C]
C10  10n  C-EUC0603  [C0603]
C11  10n  C-EUC0603  [C0603]
C12  10n  C-EUC0603  [C0603]
C13  10n  C-EUC0603  [C0603]
C14  100n  C-EUC0603  [C0603]
C15  100n  C-EUC0603  [C0603]
C16  100n  C-EUC0603  [C0603]
C17  100n  C-EUC0603  [C0603]
C18  100n  C-EUC0603  [C0603]
C19  100n  C-EUC0603  [C0603]
C20  100n  C-EUC0603  [C0603]
C21  100n  C-EUC0603  [C0603]
C25  100n  C-EUC0603  [C0603]
C26  100n  C-EUC0603  [C0603]
C27  100n  C-EUC0603  [C0603]
C28  100n  C-EUC0603  [C0603]
C29  100n  C-EUC0603  [C0603]
C30  100n  C-EUC0603  [C0603]
C47  4µ7  C-EUC0805  [C0805]
C48  1µ  C-EUC0805  [C0805]
CB1  100n  C-EUC0603  [C0603]
CC1  6n8  C-EUC0805  [C0805]
D1  MURS 140  DIODE-SMB  [SMB]
IC4  MCP1825S-1202E/DB  MCP1825DB  [SOT223]
IC5  NCP3170  [SO08]
JP8  GND  PINHD-1X1_2.54  [1X01]
L3  4µ7  INDUCTOR-PISG  [L-PISG]
R27  24k9  R-EU_M0805  [M0805]
R30  8k06  R-EU_M0805  [M0805]
RC1  4k99  R-EU_M0805  [M0805]

### Nets
+3V3: C7.+ C8.+ C14.1 C15.1 C16.1 C17.1 C18.1 C19.1 C20.1 C21.1 C25.1 C26.1 C47.1 IC4.1(IN) L3.2 R27.2 U1.P20(BVCCAUX:VCCAUX) U1.P36(BVCCAUX:VCCAUX) U1.P53(BVCCAUX:VCCAUX) U1.P90(BVCCAUX:VCCAUX) U1.P129(BVCCAUX:VCCAUX) ; also sheet 1,2,3,4,5,7
GND: C6.- C7.- C8.- C10.2 C11.2 C12.2 C13.2 C14.2 C15.2 C16.2 C17.2 C18.2 C19.2 C20.2 C21.2 C25.2 C26.2 C27.2 C28.2 C29.2 C30.2 C47.2 C48.2 CB1.2 IC4.2(GND) IC4.4(GND) IC5.1(PGND) IC5.3(AGND) JP8.1 R30.1 RC1.1 U1.P3(BGND:GND) U1.P13(BGND:GND) U1.P25(BGND:GND) U1.P49(BGND:GND) U1.P54(BGND:GND) U1.P68(BGND:GND) U1.P77(BGND:GND) U1.P91(BGND:GND) U1.P96(BGND:GND) U1.P108(BGND:GND) U1.P113(BGND:GND) U1.P130(BGND:GND) U1.P136(BGND:GND) ; also sheet 1,2,3,4,5,7
N$51: CC1.2 RC1.2
N$52: CC1.1 IC5.5(COMP)
N$53: IC5.8(VSW) L3.1
N$54: IC5.4(FB) R27.1 R30.2
USB_VBUS: D1.A ; also sheet 1,2,5
VCC: C6.+ CB1.1 D1.C IC5.2(VIN) IC5.6(EN) ; also sheet 1
VCCINT: C10.1 C11.1 C12.1 C13.1 C27.1 C28.1 C29.1 C30.1 C48.1 IC4.3(OUT) U1.P19(BVCCINT:VCCINT) U1.P28(BVCCINT:VCCINT) U1.P52(BVCCINT:VCCINT) U1.P89(BVCCINT:VCCINT) U1.P128(BVCCINT:VCCINT)
Unconnected: IC5.7(PG)

### Notes on the sheet
- FPGA Power Supply
- PISG 4,7µH => Isat 1.5A
- NCP3170A = 500kHZ, NCP3170B = 1MHz
- Quiescent Supply Current:
- 35-100mA @ 1,2V
- 2-12mA @ 3,3V

## Sheet 7 of 7
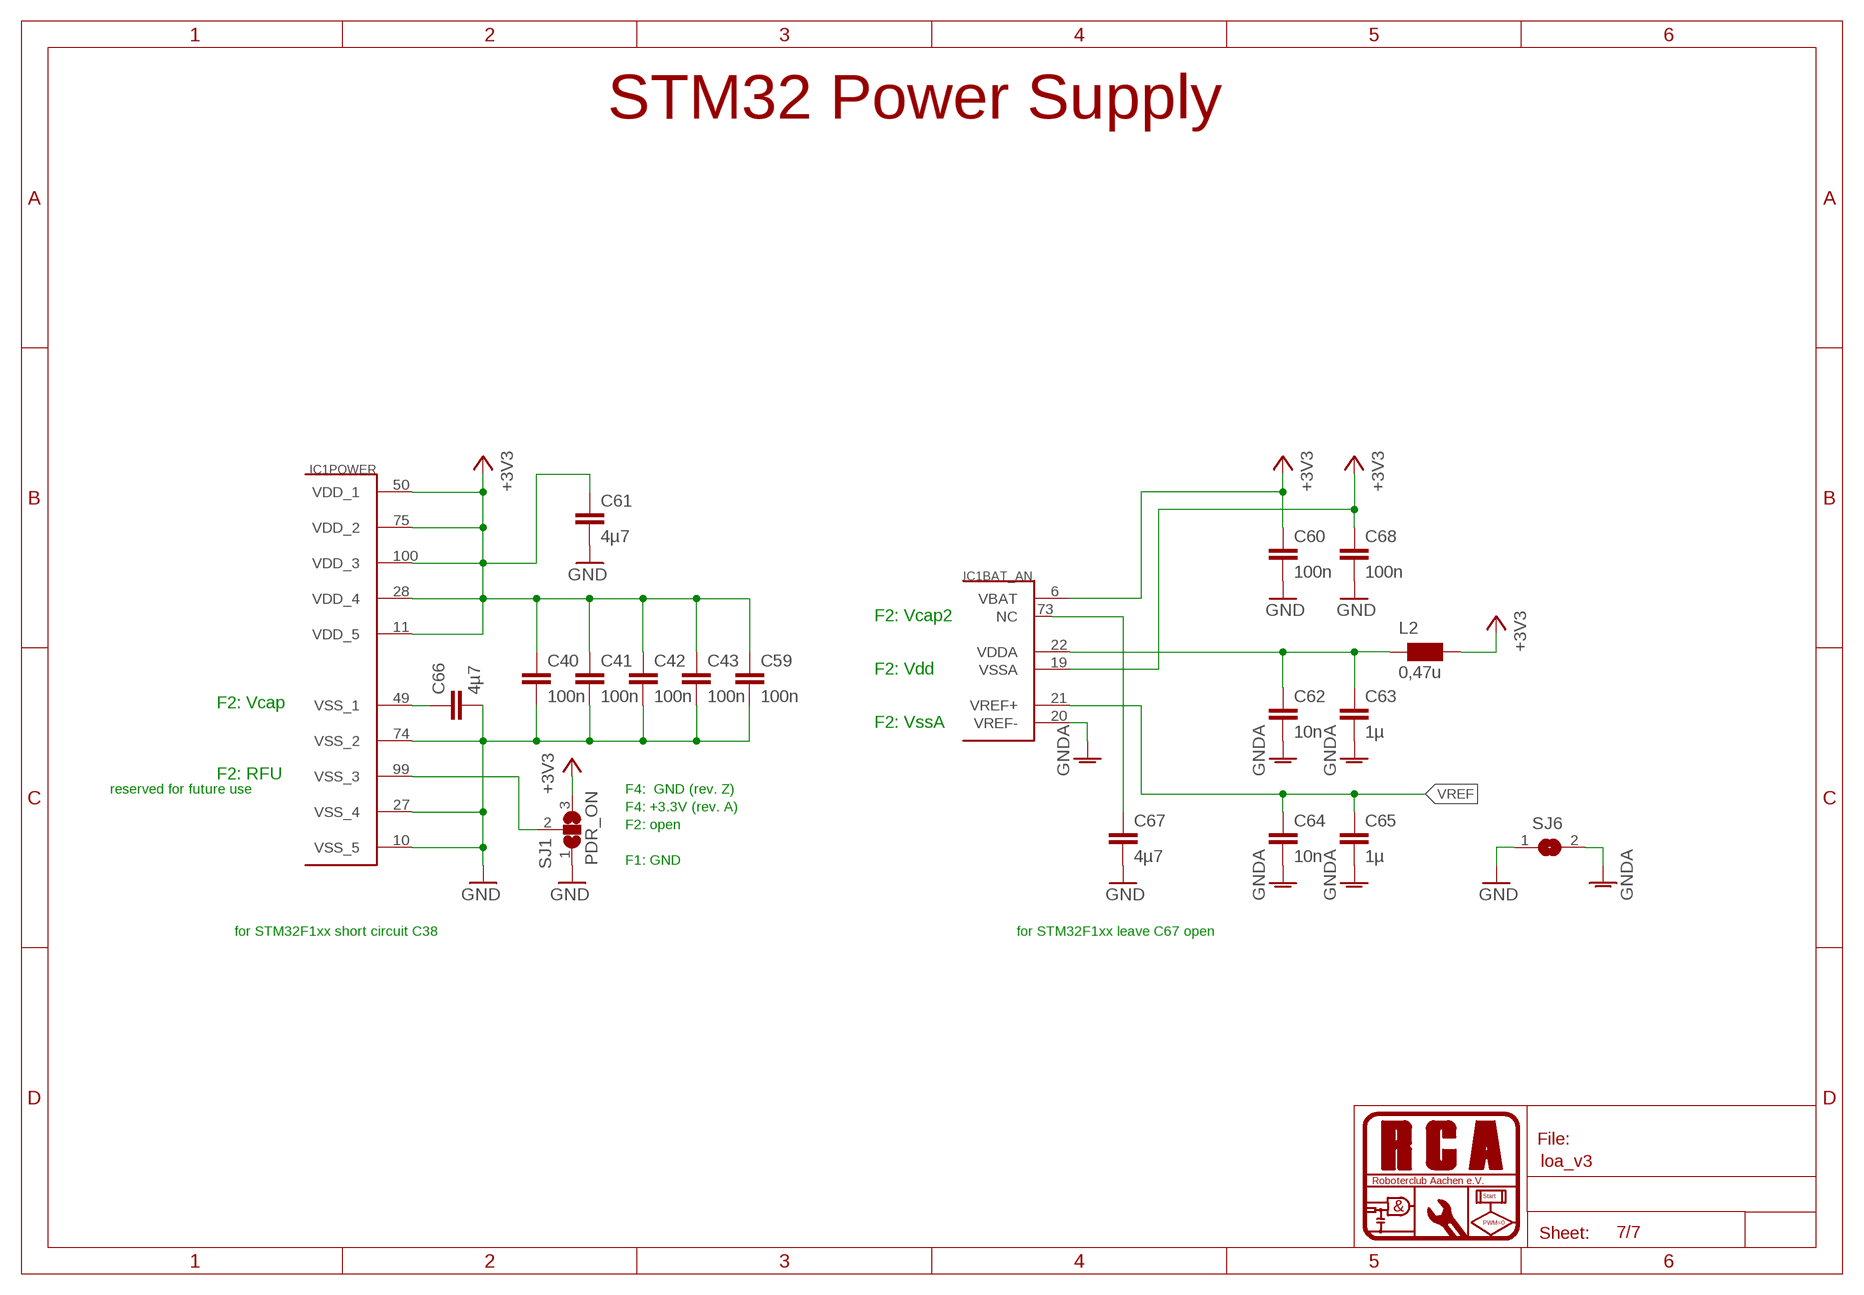
[diagram p6: schematic, sheet 7]

### Parts
C40  100n  C-EUC0603  [C0603]
C41  100n  C-EUC0603  [C0603]
C42  100n  C-EUC0603  [C0603]
C43  100n  C-EUC0603  [C0603]
C59  100n  C-EUC0603  [C0603]
C60  100n  C-EUC0603  [C0603]
C61  4µ7  C-EUC0805  [C0805]
C62  10n  C-EUC0603  [C0603]
C63  1µ  C-EUC0805  [C0805]
C64  10n  C-EUC0603  [C0603]
C65  1µ  C-EUC0805  [C0805]
C66  4µ7  C-EUC0805  [C0805]
C67  4µ7  C-EUC0805  [C0805]
C68  100n  C-EUC0603  [C0603]
L2  0,47u  WE-KIHQ_0805  [WE-KI_0805_B]
SJ1  PDR_ON  SJ2WS  [SJ_2S]
SJ6  SJS  [SJS]

### Nets
+3V3: C40.1 C41.1 C42.1 C43.1 C59.1 C60.1 C61.1 C68.1 IC1.6(BAT_AN:VBAT) IC1.11(POWER:VDD_5) IC1.19(BAT_AN:VSSA) IC1.28(POWER:VDD_4) IC1.50(POWER:VDD_1) IC1.75(POWER:VDD_2) IC1.100(POWER:VDD_3) L2.1 SJ1.3 ; also sheet 1,2,3,4,5,6
GND: C40.2 C41.2 C42.2 C43.2 C59.2 C60.2 C61.2 C66.2 C67.2 C68.2 IC1.10(POWER:VSS_5) IC1.27(POWER:VSS_4) IC1.74(POWER:VSS_2) SJ1.1 SJ6.1 ; also sheet 1,2,3,4,5,6
GNDA: C62.2 C63.2 C64.2 C65.2 IC1.20(BAT_AN:VREF-) SJ6.2 ; also sheet 1
N$4: IC1.99(POWER:VSS_3) SJ1.2
N$38: C66.1 IC1.49(POWER:VSS_1)
N$39: C67.1 IC1.73(BAT_AN:NC)
VDDA: C62.1 C63.1 IC1.22(BAT_AN:VDDA) L2.2
VREF: C64.1 C65.1 IC1.21(BAT_AN:VREF+) ; also sheet 1

### Notes on the sheet
- STM32 Power Supply
- F2: Vcap2
- F2: Vdd
- F2: Vcap
- F2: VssA
- F2: RFU
- reserved for future use | F4:  GND (rev. Z)
- F4: +3.3V (rev. A)
- F2: open
- F1: GND
- for STM32F1xx short circuit C38 | for STM32F1xx leave C67 open

## Library data of the parts
C1 C2 C9-C21 C25-C30 C34 C40-C43 C45 C46 C54-C56 C59 C60 C68 CB1 = rcl:C-EU: CAPACITOR, European symbol
C6 = rcl:CPOL-EU: POLARIZED CAPACITOR, European symbol; REICHELT#: SMD TAN.22/20; VOLTAGE: 20V
C7 C8 C52 = rcl:CPOL-EU: POLARIZED CAPACITOR, European symbol; REICHELT#: SMD TAN.22/6,3; VOLTAGE: 6,3V
C23 C24 C48 C57 C58 C63 C65 = rcl:C-EU: CAPACITOR, European symbol; REICHELT#: X7R-G0805 1,0/25
C47 C61 C66 C67 = rcl:C-EU: CAPACITOR, European symbol; REICHELT#: X5R-G0805 4,7
C62 C64 = rcl:C-EU: CAPACITOR, European symbol; REICHELT#: X7R-G0603 1,0N
CC1 = rcl:C-EU: CAPACITOR, European symbol; REICHELT#: X7R-G0805 6,8N
D1 = diode:DIODE-: DIODE; REICHELT#: MURS 140 SMD
IC1 = stm32:STM32F10XVXT6: STM32F101/103 100 pin LQFP; DIGIKEY#: 497-11605-ND
IC2 = rca_ic:M25P*: Micron M25P80 Serial Flash Embedded Memory SPI bus-compatible serial interface 8Mb Flash memory 75 MHz clock frequency (maximum) 2.7V to 3.6V single supply voltage Page program (up to 256 bytes) in 0.64ms (TYP) Erase capability Sector erase: 512Kb in 0.6 s (TYP) Bulk erase: 8Mb in 8 s (TYP) Write protection Hardware write protection: protected area size defined by nonvolatile bits BP0, BP1, BP2 Deep power-down: 1μA (TYP); DIGIKEY#: M25P80-VMN6TPCT-ND
IC3 = rca_ic:NAND_FLASH: NAND Flash Memory http://www.spansion.com/Support/Datasheets/S34ML08G2.pdf; DIGIKEY#: 1274-1042-ND; MANF: Spansion; OC_FARNELL: unknown; OC_NEWARK: unknown
IC4 = rca_spgversorgung:MCP182*; DIGIKEY#: MCP1825S-1202E/DB-ND
IC5 = rca_spgversorgung:NCP3170: Synchronous PWM Switching Converter The NCP3170 is a flexible synchronous PWM Switching Buck Regulator. The NCP3170 operates from 4.5V to 18V, sourcing up to 3A and is capable of producing output voltages as low as 0.8V. The NCP3170 also incorporates current mode control. To reduce the number of external components, a number of features are internally set including soft start, power good detection, and switching frequency. The NCP3170 is currently available in an SOIC-8 package.; DIGIKEY#: NCP3170ADR2GOSCT-ND
IC6 = rca_ic:AD726*: AD7266/5 Differential/Single-Ended Input, Dual 2 MSPS, 12-Bit, 3-Channel SAR ADC Dual 12-bit, 3-channel ADC Throughput rate: 2 MSPS Specified for VDD of 2.7 V to 5.25 V Power consumption 9 mW at 1.5 MSPS with 3 V supplies 27 mW at 2 MSPS with 5 V supplies Pin-configurable analog inputs 12-channel single-ended inputs 6-channel fully differential inputs 6-channel pseudo differential inputs 70 dB SNR at 50 kHz input frequency Accurate on-chip reference: 2.5 V ±0.2% maximum @ 25°C, 20 ppm/°C maximum Dual conversion with read 437.5 ns, 32 MHz SCLK High speed serial interface SPI®-/QSPITM-/MICROWIRETM-/DSP-compatible ?40°C to +125°C operation Shutdown mode: 1 ?A maximum 1 MSPS version, AD7265; DIGIKEY#: AD7265BSUZ-ND
JP1 JP4 JP6 JP7 = pinhead2:PINHD-2X16: PIN HEADER
JP2 JP11 = rca_stecker:CORTEX_JTAG: TCLK is SWCLK (Serial Wire Clock) TMS is SWDIO (Serial Wire debug Data Input/Output) TDO is SWO (Serial Wire trace Output); REICHELT#: WSL 10G
JP3 = pinhead2:PINHD-1X3: PIN HEADER
JP5 = rca_stecker:SD_DETECT; DIGIKEY#: WM3295CT-ND
JP8 = pinhead2:PINHD-1X1: PIN HEADER
L2 L4 = wuerth-elektronik:WE-KIHQ: SMD Wire Wound Ceramic Inductor WE-KIHQ - High current - Highest Quality factor in size 0805 - up to 98 - High thermal stability - High SRF -- Bluetooth -- Wireless LAN -- RF oscillation circuit -- IF impedance matching -- IG choke; REICHELT#: JCI 2012 0,47µ
L3 = rca_sontiges:INDUCTOR: SMD-Power-Induktivitäten z.B. PISM, Ferrit, 150µ, Reichelt Bestellnr.: L-PISM 150µ; REICHELT#: L-PISG 4,7µ
LED1 = led:LED: LED OSRAM: - CHIPLED LG R971, LG N971, LY N971, LG Q971, LY Q971, LO R971, LY R971 LH N974, LH R974 LS Q976, LO Q976, LY Q976 LO Q996 - Hyper CHIPLED LW Q18S LB Q993, LB Q99A, LB R99A - SideLED LS A670, LO A670, LY A670, LG A670, LP A670 LB A673, LV A673, LT A673, LW A673 LH A674 LY A675 LS A676, LA A676, LO A676, LY A676, LW A676 LS A679, LY A679, LG A679 - Hyper Micro SIDELED® LS Y876, LA Y876, LO Y876, LY Y876 LT Y87S - SmartLED LW L88C, LW L88S LB L89C, LB L89S, LG L890 LS L89K, LO L89K, LY L89K LS L896, LA L896, LO L896, LY L896 - TOPLED LS T670, LO T670, LY T670, LG T670, LP T670 LSG T670, LSP T670, LSY T670, LOP T670, LYG T670 LG T671, LOG T671, LSG T671 LB T673, LV T673, LT T673, LW T673 LH T674 LS T676, LA T676, LO T676, LY T676, LB T676, LH T676, LSB T676, LW T676 LB T67C, LV T67C, LT T67C, LS T67K, LO T67K, LY T67K, LW E67C LS E67B, LA E67B, LO E67B, LY E67B, LB E67C, LV E67C, LT E67C LW T67C LS T679, LY T679, LG T679 LS T770, LO T770, LY T770, LG T770, LP T770 LB T773, LV T773, LT T773, LW T773 LH T774 LS E675, LA E675, LY E675, LS T675 LS T776, LA T776, LO T776, LY T776, LB T776 LHGB T686 LT T68C, LB T68C - Hyper Mini TOPLED® LB M676 - Mini TOPLED Santana® LG M470 LS M47K, LO M47K, LY M47K Source: http://www.osram.convergy.de LUXEON: - LUMILED® LXK2-PW12-R00, LXK2-PW12-S00, LXK2-PW14-U00, LXK2-PW14-V00 LXK2-PM12-R00, LXK2-PM12-S00, LXK2-PM14-U00 LXK2-PE12-Q00, LXK2-PE12-R00, LXK2-PE12-S00, LXK2-PE14-T00, LXK2-PE14-U00 LXK2-PB12-K00, LXK2-PB12-L00, LXK2-PB12-M00, LXK2-PB14-N00, LXK2-PB14-P00, LXK2-PB14-Q00 LXK2-PR12-L00, LXK2-PR12-M00, LXK2-PR14-Q00, LXK2-PR14-R00 LXK2-PD12-Q00, LXK2-PD12-R00, LXK2-PD12-S00 LXK2-PH12-R00, LXK2-PH12-S00 LXK2-PL12-P00, LXK2-PL12-Q00, LXK2-PL12-R00 Source: www.luxeon.com KINGBRIGHT: KA-3528ASYC Source: www.kingbright.com; REICHELT#: SMD-LED 0805 RT
LED2 = led:LED: LED OSRAM: - CHIPLED LG R971, LG N971, LY N971, LG Q971, LY Q971, LO R971, LY R971 LH N974, LH R974 LS Q976, LO Q976, LY Q976 LO Q996 - Hyper CHIPLED LW Q18S LB Q993, LB Q99A, LB R99A - SideLED LS A670, LO A670, LY A670, LG A670, LP A670 LB A673, LV A673, LT A673, LW A673 LH A674 LY A675 LS A676, LA A676, LO A676, LY A676, LW A676 LS A679, LY A679, LG A679 - Hyper Micro SIDELED® LS Y876, LA Y876, LO Y876, LY Y876 LT Y87S - SmartLED LW L88C, LW L88S LB L89C, LB L89S, LG L890 LS L89K, LO L89K, LY L89K LS L896, LA L896, LO L896, LY L896 - TOPLED LS T670, LO T670, LY T670, LG T670, LP T670 LSG T670, LSP T670, LSY T670, LOP T670, LYG T670 LG T671, LOG T671, LSG T671 LB T673, LV T673, LT T673, LW T673 LH T674 LS T676, LA T676, LO T676, LY T676, LB T676, LH T676, LSB T676, LW T676 LB T67C, LV T67C, LT T67C, LS T67K, LO T67K, LY T67K, LW E67C LS E67B, LA E67B, LO E67B, LY E67B, LB E67C, LV E67C, LT E67C LW T67C LS T679, LY T679, LG T679 LS T770, LO T770, LY T770, LG T770, LP T770 LB T773, LV T773, LT T773, LW T773 LH T774 LS E675, LA E675, LY E675, LS T675 LS T776, LA T776, LO T776, LY T776, LB T776 LHGB T686 LT T68C, LB T68C - Hyper Mini TOPLED® LB M676 - Mini TOPLED Santana® LG M470 LS M47K, LO M47K, LY M47K Source: http://www.osram.convergy.de LUXEON: - LUMILED® LXK2-PW12-R00, LXK2-PW12-S00, LXK2-PW14-U00, LXK2-PW14-V00 LXK2-PM12-R00, LXK2-PM12-S00, LXK2-PM14-U00 LXK2-PE12-Q00, LXK2-PE12-R00, LXK2-PE12-S00, LXK2-PE14-T00, LXK2-PE14-U00 LXK2-PB12-K00, LXK2-PB12-L00, LXK2-PB12-M00, LXK2-PB14-N00, LXK2-PB14-P00, LXK2-PB14-Q00 LXK2-PR12-L00, LXK2-PR12-M00, LXK2-PR14-Q00, LXK2-PR14-R00 LXK2-PD12-Q00, LXK2-PD12-R00, LXK2-PD12-S00 LXK2-PH12-R00, LXK2-PH12-S00 LXK2-PL12-P00, LXK2-PL12-Q00, LXK2-PL12-R00 Source: www.luxeon.com KINGBRIGHT: KA-3528ASYC Source: www.kingbright.com; REICHELT#: SMD-LED 0805 GE
LED3 LED9 = led:LED: LED OSRAM: - CHIPLED LG R971, LG N971, LY N971, LG Q971, LY Q971, LO R971, LY R971 LH N974, LH R974 LS Q976, LO Q976, LY Q976 LO Q996 - Hyper CHIPLED LW Q18S LB Q993, LB Q99A, LB R99A - SideLED LS A670, LO A670, LY A670, LG A670, LP A670 LB A673, LV A673, LT A673, LW A673 LH A674 LY A675 LS A676, LA A676, LO A676, LY A676, LW A676 LS A679, LY A679, LG A679 - Hyper Micro SIDELED® LS Y876, LA Y876, LO Y876, LY Y876 LT Y87S - SmartLED LW L88C, LW L88S LB L89C, LB L89S, LG L890 LS L89K, LO L89K, LY L89K LS L896, LA L896, LO L896, LY L896 - TOPLED LS T670, LO T670, LY T670, LG T670, LP T670 LSG T670, LSP T670, LSY T670, LOP T670, LYG T670 LG T671, LOG T671, LSG T671 LB T673, LV T673, LT T673, LW T673 LH T674 LS T676, LA T676, LO T676, LY T676, LB T676, LH T676, LSB T676, LW T676 LB T67C, LV T67C, LT T67C, LS T67K, LO T67K, LY T67K, LW E67C LS E67B, LA E67B, LO E67B, LY E67B, LB E67C, LV E67C, LT E67C LW T67C LS T679, LY T679, LG T679 LS T770, LO T770, LY T770, LG T770, LP T770 LB T773, LV T773, LT T773, LW T773 LH T774 LS E675, LA E675, LY E675, LS T675 LS T776, LA T776, LO T776, LY T776, LB T776 LHGB T686 LT T68C, LB T68C - Hyper Mini TOPLED® LB M676 - Mini TOPLED Santana® LG M470 LS M47K, LO M47K, LY M47K Source: http://www.osram.convergy.de LUXEON: - LUMILED® LXK2-PW12-R00, LXK2-PW12-S00, LXK2-PW14-U00, LXK2-PW14-V00 LXK2-PM12-R00, LXK2-PM12-S00, LXK2-PM14-U00 LXK2-PE12-Q00, LXK2-PE12-R00, LXK2-PE12-S00, LXK2-PE14-T00, LXK2-PE14-U00 LXK2-PB12-K00, LXK2-PB12-L00, LXK2-PB12-M00, LXK2-PB14-N00, LXK2-PB14-P00, LXK2-PB14-Q00 LXK2-PR12-L00, LXK2-PR12-M00, LXK2-PR14-Q00, LXK2-PR14-R00 LXK2-PD12-Q00, LXK2-PD12-R00, LXK2-PD12-S00 LXK2-PH12-R00, LXK2-PH12-S00 LXK2-PL12-P00, LXK2-PL12-Q00, LXK2-PL12-R00 Source: www.luxeon.com KINGBRIGHT: KA-3528ASYC Source: www.kingbright.com; REICHELT#: SMD-LED 0805 GN
LED10 = led:LED: LED OSRAM: - CHIPLED LG R971, LG N971, LY N971, LG Q971, LY Q971, LO R971, LY R971 LH N974, LH R974 LS Q976, LO Q976, LY Q976 LO Q996 - Hyper CHIPLED LW Q18S LB Q993, LB Q99A, LB R99A - SideLED LS A670, LO A670, LY A670, LG A670, LP A670 LB A673, LV A673, LT A673, LW A673 LH A674 LY A675 LS A676, LA A676, LO A676, LY A676, LW A676 LS A679, LY A679, LG A679 - Hyper Micro SIDELED® LS Y876, LA Y876, LO Y876, LY Y876 LT Y87S - SmartLED LW L88C, LW L88S LB L89C, LB L89S, LG L890 LS L89K, LO L89K, LY L89K LS L896, LA L896, LO L896, LY L896 - TOPLED LS T670, LO T670, LY T670, LG T670, LP T670 LSG T670, LSP T670, LSY T670, LOP T670, LYG T670 LG T671, LOG T671, LSG T671 LB T673, LV T673, LT T673, LW T673 LH T674 LS T676, LA T676, LO T676, LY T676, LB T676, LH T676, LSB T676, LW T676 LB T67C, LV T67C, LT T67C, LS T67K, LO T67K, LY T67K, LW E67C LS E67B, LA E67B, LO E67B, LY E67B, LB E67C, LV E67C, LT E67C LW T67C LS T679, LY T679, LG T679 LS T770, LO T770, LY T770, LG T770, LP T770 LB T773, LV T773, LT T773, LW T773 LH T774 LS E675, LA E675, LY E675, LS T675 LS T776, LA T776, LO T776, LY T776, LB T776 LHGB T686 LT T68C, LB T68C - Hyper Mini TOPLED® LB M676 - Mini TOPLED Santana® LG M470 LS M47K, LO M47K, LY M47K Source: http://www.osram.convergy.de LUXEON: - LUMILED® LXK2-PW12-R00, LXK2-PW12-S00, LXK2-PW14-U00, LXK2-PW14-V00 LXK2-PM12-R00, LXK2-PM12-S00, LXK2-PM14-U00 LXK2-PE12-Q00, LXK2-PE12-R00, LXK2-PE12-S00, LXK2-PE14-T00, LXK2-PE14-U00 LXK2-PB12-K00, LXK2-PB12-L00, LXK2-PB12-M00, LXK2-PB14-N00, LXK2-PB14-P00, LXK2-PB14-Q00 LXK2-PR12-L00, LXK2-PR12-M00, LXK2-PR14-Q00, LXK2-PR14-R00 LXK2-PD12-Q00, LXK2-PD12-R00, LXK2-PD12-S00 LXK2-PH12-R00, LXK2-PH12-S00 LXK2-PL12-P00, LXK2-PL12-Q00, LXK2-PL12-R00 Source: www.luxeon.com KINGBRIGHT: KA-3528ASYC Source: www.kingbright.com; REICHELT#: SMD-LED 0805 BL
Q2 = rca_sontiges:XO: XO91 Series Oscillators Frequency Range 500 kHz to 125 MHz Supply voltage range 1.8, 2.5, 3.3 or 5.0 Volts Gibt es in der 3,3V Version bei Reichelt (XO91 #Wert) Datenblatt: http://www.reichelt.de/?;ACTION=7;LA=6;OPEN=0;INDEX=0;FILENAME=B400%252FXO91.pdf XO53 Series Oscillators Frequency Range 2.5 MHz to 125 MHz Supply voltage range 1.8, 2.5, 3.3 Volts Gibt es in der 3,3V Version bei Reichelt (XO53 #Wert); REICHELT#: XO53 50,00000
Q3 = rca_sontiges:XO: XO91 Series Oscillators Frequency Range 500 kHz to 125 MHz Supply voltage range 1.8, 2.5, 3.3 or 5.0 Volts Gibt es in der 3,3V Version bei Reichelt (XO91 #Wert) Datenblatt: http://www.reichelt.de/?;ACTION=7;LA=6;OPEN=0;INDEX=0;FILENAME=B400%252FXO91.pdf XO53 Series Oscillators Frequency Range 2.5 MHz to 125 MHz Supply voltage range 1.8, 2.5, 3.3 Volts Gibt es in der 3,3V Version bei Reichelt (XO53 #Wert); REICHELT#: XO53 25,00000
R1-R15 R22 R26 R28 R29 R32 = rcl:R-EU_: RESISTOR, European symbol
R27 = rcl:R-EU_: RESISTOR, European symbol; DIGIKEY#: 311-24.9KCRCT-ND
R30 = rcl:R-EU_: RESISTOR, European symbol; DIGIKEY#: 311-8.06KCRCT-ND
RC1 = rcl:R-EU_: RESISTOR, European symbol; DIGIKEY#: 311-4.99KCRCT-ND
RN3 RN4 RN6 RN7 = resistor-dil:4R-N: Array Chip Resistor Source: RS Component / Phycomp; OC_FARNELL: unknown; OC_NEWARK: unknown; REICHELT#: BCN16 100
S2 = rca_sontiges:10-XX*: OMRON SWITCH; REICHELT#: TASTER 9315
SJ1 SJ2 = rca_sontiges:SJ2W: SMD solder JUMPER
SJ3 SJ6 = rca_sontiges:SJ: SMD solder JUMPER
U1 = xilinx_devices:6SLX9TQG144: Xilinx FPGA: 6SLX9TQG144; DIGIKEY#: 122-1745-ND
X3 = con-cypressindustries:MINI-USB-SCHIELD-: MINI USB-B Conector Source: www.cypressindustries.com; REICHELT#: USB BWM SMD